# Altium project RPi-GS-CAM-SER_V1-0.PrjPcb
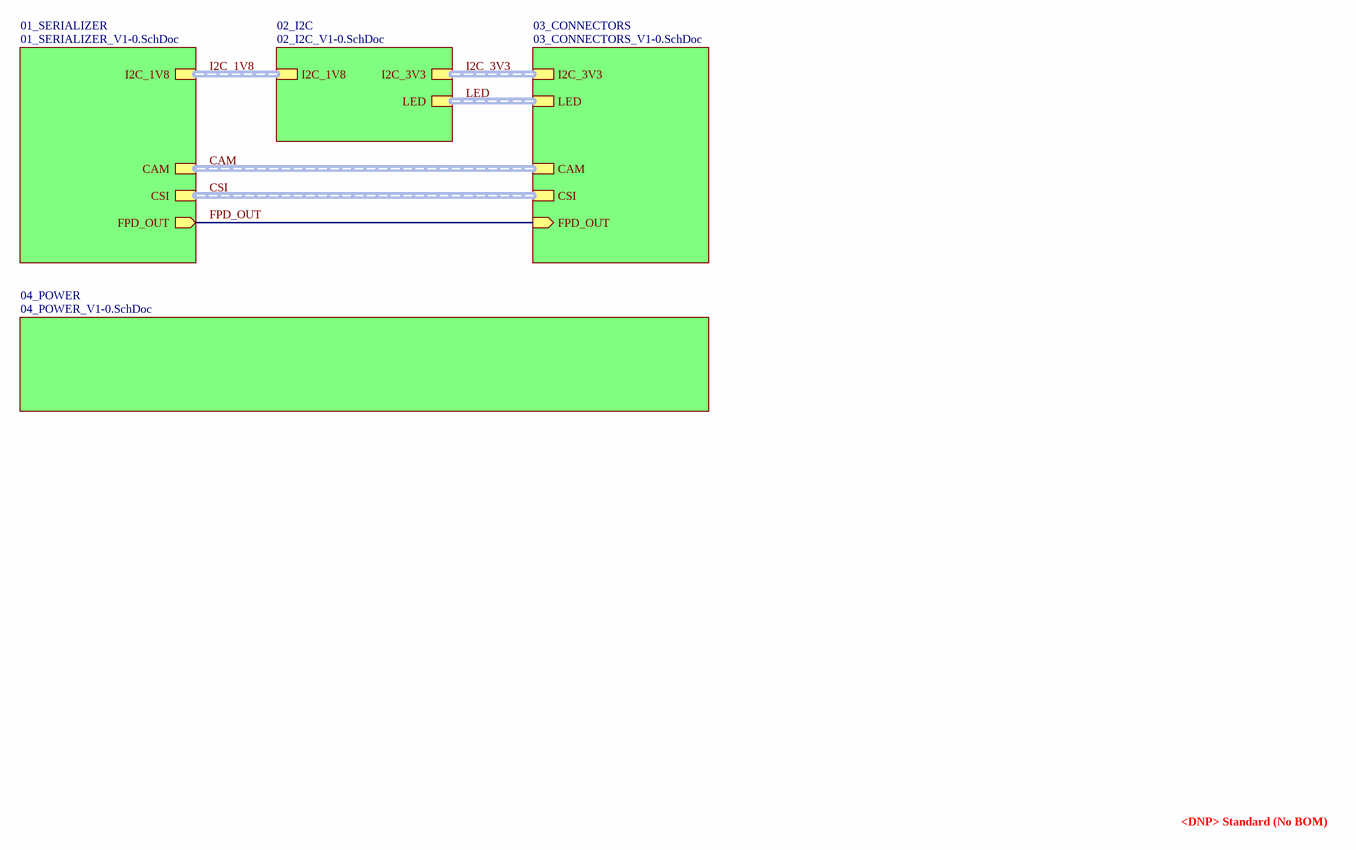
[diagram p0: 00_RPi-GS-CAM-SER_V1-0.SchDoc]
5 sheets, 156 parts. Net scope: hierarchical (ports join the sheet entries above them; power ports are global).
Board file: RPi-GS-CAM-SER_V1-0.PcbDoc
Sheets:
  00_RPi-GS-CAM-SER_V1-0.SchDoc
    01_SERIALIZER = 01_SERIALIZER_V1-0.SchDoc
    03_CONNECTORS = 03_CONNECTORS_V1-0.SchDoc
    04_POWER = 04_POWER_V1-0.SchDoc
    02_I2C = 02_I2C_V1-0.SchDoc

## Sheet 00_RPi-GS-CAM-SER_V1-0.SchDoc: RPi GS CAM SER.
size A3; Date: 2023-05-29; Author: M. Weimann; Organization: Altium Limited; Revision: 1.0; SheetNumber: 1; SheetTotal: 5; Title_Subtitle: Block Diagramm; Language: DE; Department: F&E; Filename: RPi-GS-CAM-SER_PCB_V1-0.PDF; Project: PI-0017; DocType: Stromlauf; ItemNo-PCB: n/a

### Sub-sheets
01_SERIALIZER = 01_SERIALIZER_V1-0.SchDoc: CSI (harness CSI), I2C_1V8 (harness I2C_1V8), CAM (harness CAM), FPD_OUT (out)
02_I2C = 02_I2C_V1-0.SchDoc: LED (harness LED), I2C_3V3 (harness I2C_3V3), I2C_1V8 (harness I2C_1V8)
03_CONNECTORS = 03_CONNECTORS_V1-0.SchDoc: FPD_OUT (in), I2C_3V3 (harness I2C_3V3), LED (harness LED), CSI (harness CSI), CAM (harness CAM)
04_POWER = 04_POWER_V1-0.SchDoc: no entries

### Nets
FPD_OUT: sheet 01_SERIALIZER/FPD_OUT, sheet 03_CONNECTORS/FPD_OUT

### Buses and harness runs
harness CAM = sheet 01_SERIALIZER/CAM = sheet 03_CONNECTORS/CAM
harness CSI = sheet 01_SERIALIZER/CSI = sheet 03_CONNECTORS/CSI
harness I2C_1V8 = sheet 01_SERIALIZER/I2C_1V8 = sheet 02_I2C/I2C_1V8
harness I2C_3V3 = sheet 02_I2C/I2C_3V3 = sheet 03_CONNECTORS/I2C_3V3
harness LED = sheet 02_I2C/LED = sheet 03_CONNECTORS/LED

### Notes on the sheet
- <DNP> Standard (No BOM)
- Erstellt von
- Dateiname
- ++CONFIDENTIAL++
- PCB Arts GmbH
- Dokumententyp
- Artikel-Nummer (PCB)
- Kurgartenstraße 59
- 90762 Fürth
- Elektronik- und Softwareentwicklung
- Titel, Sub-Titel
- Projekt
- Rev.
- Datum
- Sprache
- Seite
- The  information  contained  in  these  documents  is  confidential,  privileged  and  only  for  the
  information of the intended recipient and may
  not be used, published or redistributed without
  the prior written consent from PCB Arts GmbH.
- https://pcb-arts.com/
- mail@pcb-arts.com

## Sheet 01_SERIALIZER_V1-0.SchDoc: RPi GS CAM SER.
size A3; Date: 2023-05-29; Author: M. Weimann; Organization: Altium Limited; Revision: 1.0; SheetNumber: 2; SheetTotal: 5; Title_Subtitle: Serializer; Language: DE; Department: F&E; Filename: RPi-GS-CAM-SER_PCB_V1-0.PDF; Project: PI-0017; DocType: Stromlauf; ItemNo-PCB: n/a
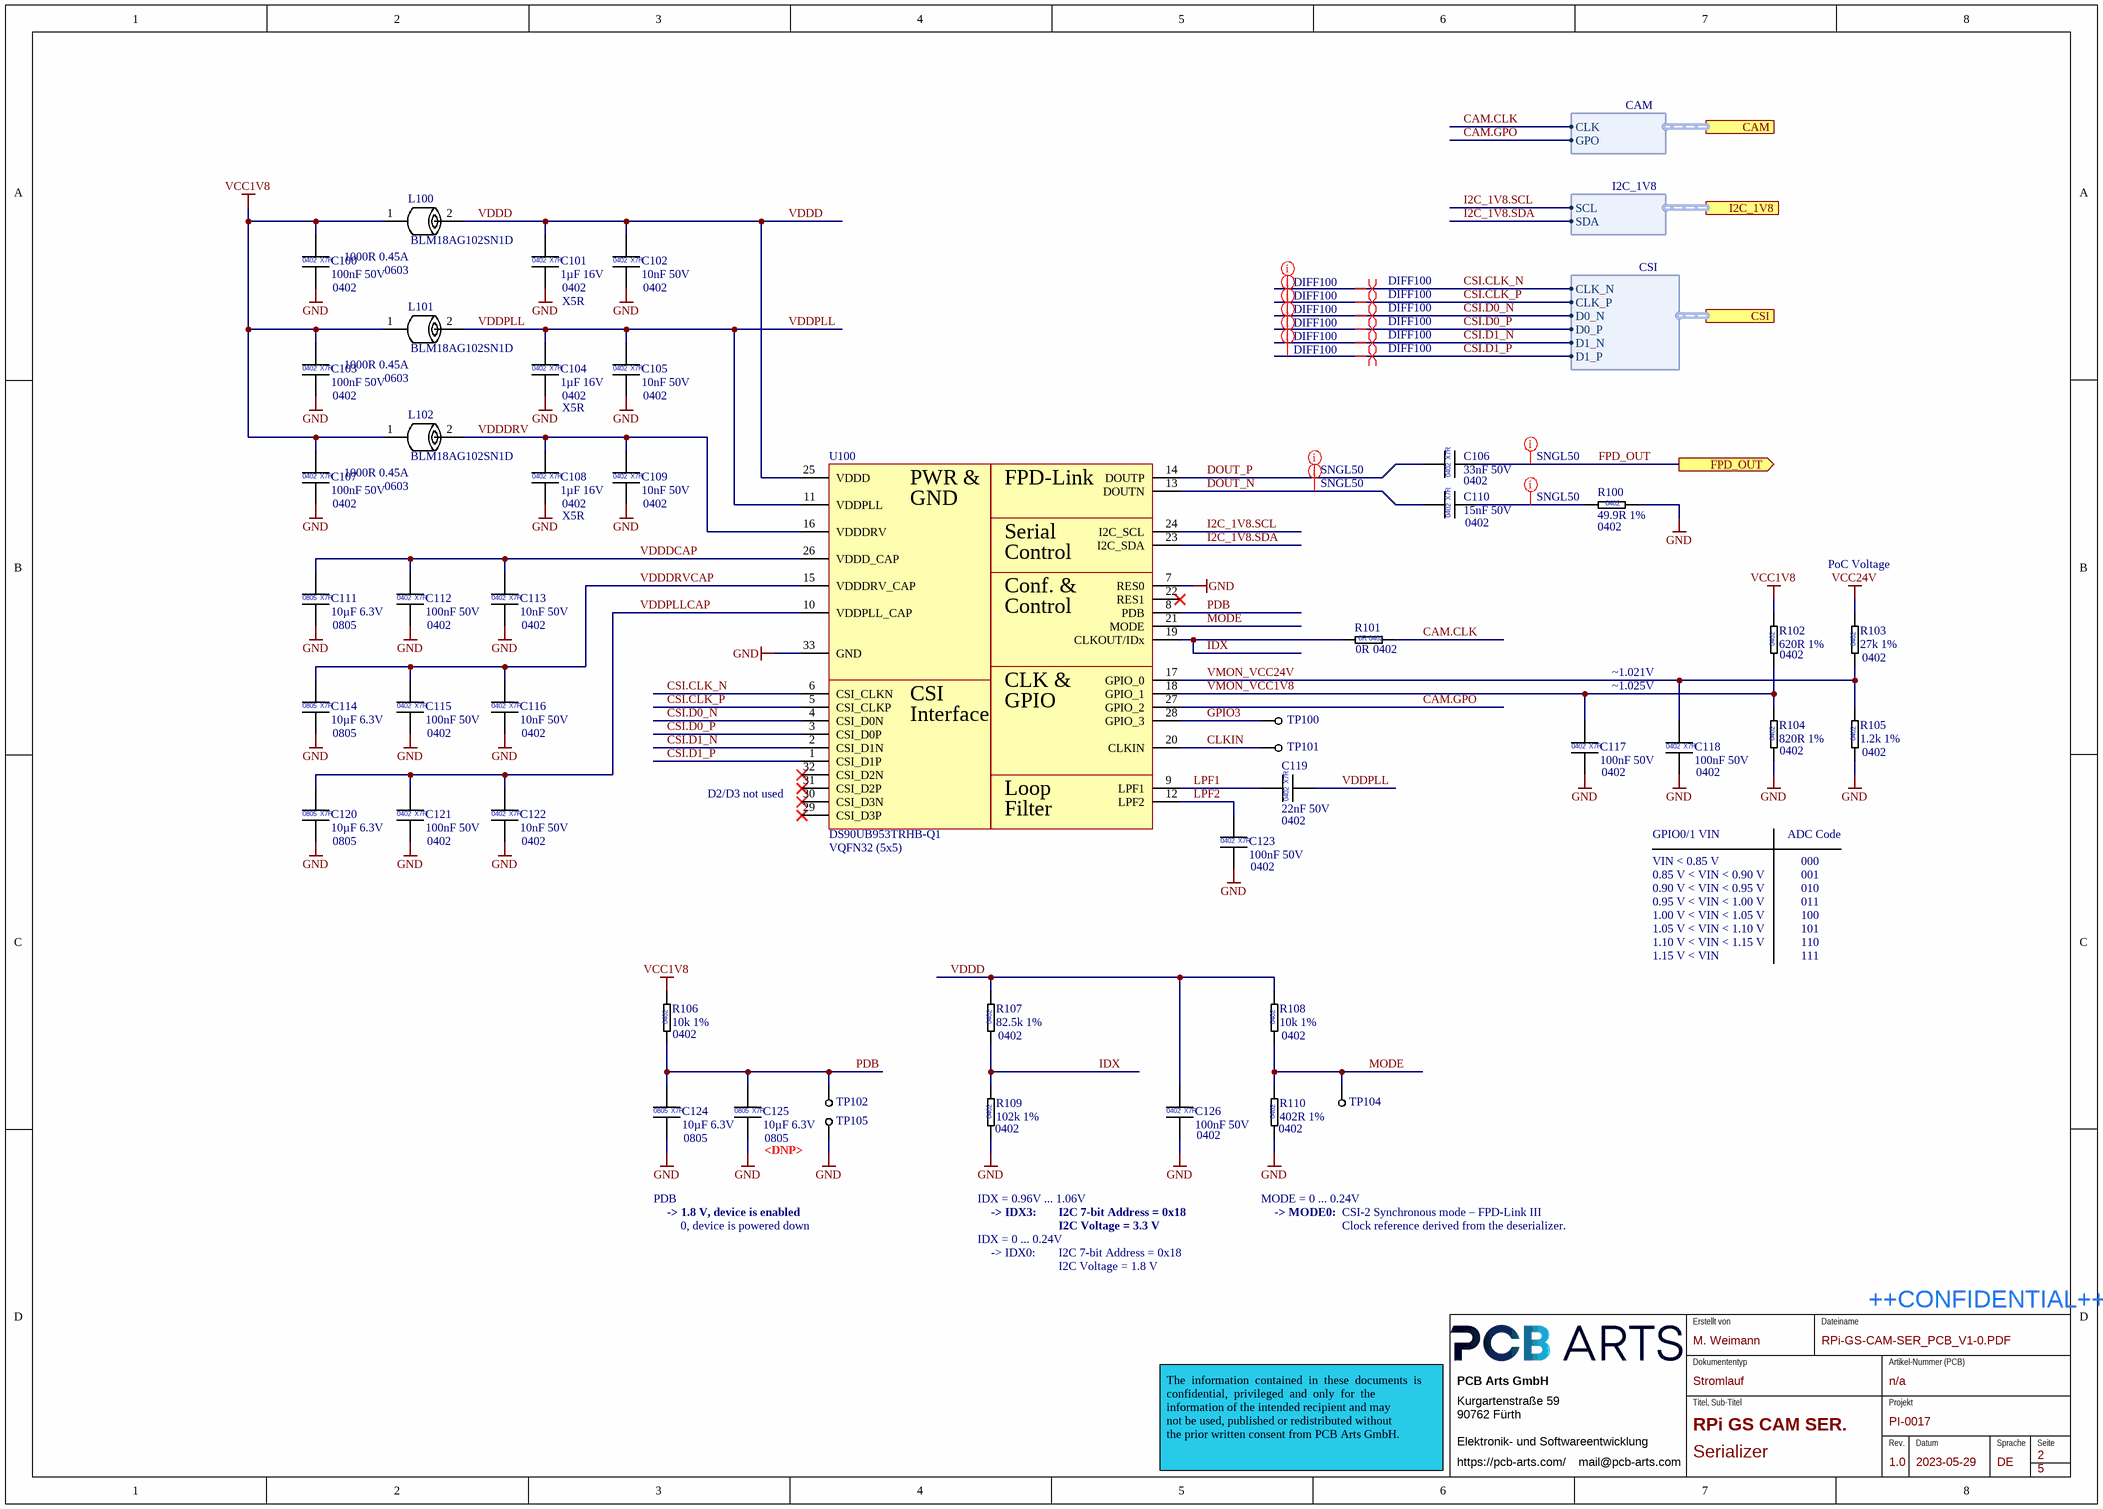
[diagram p1: 01_SERIALIZER_V1-0.SchDoc]

### Parts
C100  100nF 50V  [CAP_0402_L]
C101  1µF 16V  [CAP_0402_L]
C102  10nF 50V  [CAP_0402_L]
C103  100nF 50V  [CAP_0402_L]
C104  1µF 16V  [CAP_0402_L]
C105  10nF 50V  [CAP_0402_L]
C106  33nF 50V  [CAP_0402_L]
C107  100nF 50V  [CAP_0402_L]
C108  1µF 16V  [CAP_0402_L]
C109  10nF 50V  [CAP_0402_L]
C110  15nF 50V  [CAP_0402_L]
C111  10µF 6.3V  [CAP_0805]
C112  100nF 50V  [CAP_0402_L]
C113  10nF 50V  [CAP_0402_L]
C114  10µF 6.3V  [CAP_0805]
C115  100nF 50V  [CAP_0402_L]
C116  10nF 50V  [CAP_0402_L]
C117  100nF 50V  [CAP_0402_L]
C118  100nF 50V  [CAP_0402_L]
C119  22nF 50V  [CAP_0402_L]
C120  10µF 6.3V  [CAP_0805]
C121  100nF 50V  [CAP_0402_L]
C122  10nF 50V  [CAP_0402_L]
C123  100nF 50V  [CAP_0402_L]
C124  10µF 6.3V  [CAP_0805]
C125  10µF 6.3V  [CAP_0805]  (no BOM)
C126  100nF 50V  [CAP_0402_L]
L100  BLM18AG102SN1D  [L_0603]
L101  BLM18AG102SN1D  [L_0603]
L102  BLM18AG102SN1D  [L_0603]
R100  49.9R 1%  [RES_0402_L]
R101  0R Jumper  [RES_0402_L]  (value not drawn)
R102  620R 1%  [RES_0402_L]
R103  27k 1%  [RES_0402_L]
R104  820R 1%  [RES_0402_L]
R105  1.2k 1%  [RES_0402_L]
R106  10k 1%  [RES_0402_L]
R107  82.5k 1%  [RES_0402_L]
R108  10k 1%  [RES_0402_L]
R109  102k 1%  [RES_0402_L]
R110  402R 1%  [RES_0402_L]
TP100  Testpoint  [Testpoint 0.8mm]  (value not drawn)  (no BOM)
TP101  Testpoint  [Testpoint 0.8mm]  (value not drawn)  (no BOM)
TP102  Testpoint  [Testpoint 0.8mm]  (value not drawn)  (no BOM)
TP104  Testpoint  [Testpoint 0.8mm]  (value not drawn)  (no BOM)
TP105  Testpoint  [Testpoint 0.8mm]  (value not drawn)  (no BOM)
U100  DS90UB953TRHB-Q1  [VQFN50P500X500X100-33N]

### Ports
CAM (harness CAM, see 00_RPi-GS-CAM-SER_V1-0[4B], 03_CONNECTORS_V1-0[1B]), CSI (harness CSI, see 00_RPi-GS-CAM-SER_V1-0[4B], 03_CONNECTORS_V1-0[1B]), FPD_OUT (out, see 00_RPi-GS-CAM-SER_V1-0[4B], 03_CONNECTORS_V1-0[4A]), I2C_1V8 (harness I2C_1V8, see 00_RPi-GS-CAM-SER_V1-0[4B], 02_I2C_V1-0[1A])

### Harnesses
CSI: CLK_N, CLK_P, D0_N, D0_P, D1_P, D1_N
I2C_1V8: SCL, SDA
CAM: CLK, GPO

### Nets
GND: C100.2 C101.2 C102.2 C103.2 C104.2 C105.2 C107.2 C108.2 C109.2 C111.2 C112.2 C113.2 C114.2 C115.2 C116.2 C117.2 C118.2 C120.2 C121.2 C122.2 C123.2 C124.2 C125.2 C126.2 R100.2 R104.1 R105.1 R109.1 R110.1 TP105.1(GND) U100.7(RES0) U100.33(GND)
VCC1V8: C100.1 C103.1 C107.1 L100.1 L101.1 L102.1 R102.2 R106.2
VCC24V: R103.2
CAM.CLK: R101.2 ; port CAM.CLK
CAM.GPO: U100.27(GPIO_2) ; port CAM.GPO
CLKIN: TP101.1(GND) U100.20(CLKIN)
CSI.CLK_N: U100.6(CSI_CLKN) ; port CSI.CLK_N
CSI.CLK_P: U100.5(CSI_CLKP) ; port CSI.CLK_P
CSI.D0_N: U100.4(CSI_D0N) ; port CSI.D0_N
CSI.D0_P: U100.3(CSI_D0P) ; port CSI.D0_P
CSI.D1_N: U100.2(CSI_D1N) ; port CSI.D1_N
CSI.D1_P: U100.1(CSI_D1P) ; port CSI.D1_P
DOUT_N: C110.1 U100.13(DOUTN)
DOUT_P: C106.1 U100.14(DOUTP)
FPD_OUT: C106.2 ; port FPD_OUT
GPIO3: TP100.1(GND) U100.28(GPIO_3)
I2C_1V8.SCL: U100.24(I2C_SCL) ; port I2C_1V8.SCL
I2C_1V8.SDA: U100.23(I2C_SDA) ; port I2C_1V8.SDA
IDX: R101.1 R107.1 R109.2 U100.19(CLKOUT/IDx)
LPF1: C119.1 U100.9(LPF1)
LPF2: C123.1 U100.12(LPF2)
MODE: R108.1 R110.2 TP104.1(GND) U100.21(MODE)
PDB: C124.1 C125.1 R106.1 TP102.1(GND) U100.8(PDB)
VDDD: C101.1 C102.1 C126.1 L100.2 R107.2 R108.2 U100.25(VDDD)
VDDDCAP: C111.1 C112.1 C113.1 U100.26(VDDD_CAP)
VDDDRV: C108.1 C109.1 L102.2 U100.16(VDDDRV)
VDDDRVCAP: C114.1 C115.1 C116.1 U100.15(VDDDRV_CAP)
VDDPLL: C104.1 C105.1 C119.2 L101.2 U100.11(VDDPLL)
VDDPLLCAP: C120.1 C121.1 C122.1 U100.10(VDDPLL_CAP)
VMON_VCC1V8: C117.1 R102.1 R104.2 U100.18(GPIO_1)
VMON_VCC24V: C118.1 R103.1 R105.2 U100.17(GPIO_0)
NetC110_2: C110.2 R100.1

Not connected (* = marked no-connect by the designer): U100 22(RES1)* 29(CSI_D3P)* 30(CSI_D3N)* 31(CSI_D2P)* 32(CSI_D2N)*

### Layout directives
net class SNGL50: DOUT_N, DOUT_P, FPD_OUT, NetC110_2
differential pair; differential pair class DIFF100: CSI.CLK_N, CSI.CLK_P, CSI.D0_N, CSI.D0_P, CSI.D1_N, CSI.D1_P
net class DIFF100: CSI.CLK_N, CSI.CLK_P, CSI.D0_N, CSI.D0_P, CSI.D1_N, CSI.D1_P

### Notes on the sheet
- (near L100) 1000R 0.45A
- (near C100) 0402
- 0603
- (near C101) X5R
- (near C101) 0402
- (near C102) 0402
- (near L101) 1000R 0.45A
- (near C103) 0402
- (near C104) X5R
- (near C104) 0402
- (near C105) 0402
- (near C107) 0402
- (near L102) 1000R 0.45A
- (near L102) 0603
- (near C108) X5R
- (near C108) 0402
- (near C109) 0402
- 0402
- (near C110) 0402
- (near R100) 0402
- PoC Voltage
- (near C111) 0805
- (near C112) 0402
- (near C113) 0402
- (near R101) 0R
- (near R101) 0402
- ~1.021V
- ~1.025V
- (near R102) 0402
- (near R103) 0402
- (near C114) 0805
- (near C115) 0402
- (near C116) 0402
- (near C117) 0402
- (near C118) 0402
- (near R104) 0402
- (near R105) 0402
- (near C120) 0805
- (near C121) 0402
- (near C122) 0402
- (near U100) D2/D3 not used
- (near U100) VQFN32 (5x5)
- (near C119) 0402
- GPIO0/1 VIN
- ADC Code
- (near C123) 0402
- VIN < 0.85 V
- 0.85 V < VIN < 0.90 V
- 0.90 V < VIN < 0.95 V
- 0.95 V < VIN < 1.00 V
- 1.00 V < VIN < 1.05 V
- 000
- 001
- 010
- 011
- 100
- 1.05 V < VIN < 1.10 V
- 1.10 V < VIN < 1.15 V
- 1.15 V < VIN
- 101
- 110
- 111
- (near R106) 0402
- (near R107) 0402
- (near R108) 0402
- (near C124) 0805
- (near C125) 0805
- <DNP>
- (near R109) 0402
- (near C126) 0402
- (near R110) 0402
- PDB
- -> 1.8 V, device is enabled
- 0, device is powered down
- IDX = 0 ... 0.24V
- IDX = 0.96V ... 1.06V
- -> IDX0:
- -> IDX3:
- I2C 7-bit Address = 0x18
- I2C Voltage = 3.3 V
- MODE = 0 ... 0.24V
- -> MODE0:
- CSI-2 Synchronous mode – FPD-Link III
- Clock reference derived from the deserializer.
- I2C Voltage = 1.8 V
- Erstellt von
- Dateiname
- ++CONFIDENTIAL++
- PCB Arts GmbH
- Dokumententyp
- Artikel-Nummer (PCB)
- Kurgartenstraße 59
- 90762 Fürth
- Elektronik- und Softwareentwicklung
- Titel, Sub-Titel
- Projekt
- Rev.
- Datum
- Sprache
- Seite
- The  information  contained  in  these  documents  is  confidential,  privileged  and  only  for  the
  information of the intended recipient and may
  not be used, published or redistributed without
  the prior written consent from PCB Arts GmbH.
- https://pcb-arts.com/
- mail@pcb-arts.com
- (in symbol CAP_0402_1µF_16V) 0402; X7R
- (in symbol CAP_0402_10nF_50V) 0402; X7R
- (in symbol CAP_0402_15nF_50V) X7R; 0402
- (in symbol CAP_0402_22nF_50V) X7R; 0402
- (in symbol CAP_0402_33nF_50V) X7R; 0402
- (in symbol CAP_0402_100nF_50V) 0402; X7R
- (in symbol CAP_0805_10µF_6.3V_X7R_10%) 0805; X7R
- (in symbol DS90UB953TRHBTQ1_Serialiser CSI-2 Interface) PWR &; FPD-Link; Serial; Control; Conf. &; CLK &; CSI; GPIO; Interface; Loop; Filter
- (in symbol RES_0402_0R Jumper) 0R 0402
- (in symbol RES_0402_1.2k_1%) 0402
- (in symbol RES_0402_10k_1%) 0402
- (in symbol RES_0402_27k_1%) 0402
- (in symbol RES_0402_49.9R_1%) 0402
- (in symbol RES_0402_82.5k_1%) 0402
- (in symbol RES_0402_102k_1%) 0402
- (in symbol RES_0402_402R_1%) 0402
- (in symbol RES_0402_620R_1%) 0402
- (in symbol RES_0402_820R_1%) 0402

### Library data of the parts
C100 C103 C107 C112 C115 C117 C118 C121 C123 C126 = CAP_0402_100nF_50V: Multilayer Ceramic Capacitors MLCC - SMD/SMT 0402 50VDC; Manufacturer 1: Murata Electronics; Manufacturer 1 Prt. Nr.: GCM155L8EH104KE07D; Manufacturer 2 Prt. Nr.: UMK105B7104KV-FR; Manufacturer 2: TDK
C101 C104 C108 = CAP_0402_1µF_16V: Multilayer Ceramic Capacitors MLCC - SMD/SMT 0402 16VDC; Manufacturer 1: Taiyo Yuden; Manufacturer 1 Prt. Nr.: EMK105BJ105MVHF; Manufacturer 2 Prt. Nr.: GRM155R61E105KA12D; Manufacturer 2: Murata Electronics
C102 C105 C109 C113 C116 C122 = CAP_0402_10nF_50V: Multilayer Ceramic Capacitors MLCC - SMD/SMT 0402 50VDC; Manufacturer 1: Wurth Elektronik; Manufacturer 1 Prt. Nr.: 885012205067; Manufacturer 2 Prt. Nr.: AC0402KPX7R9BB103; Manufacturer 2: Yageo
C106 = CAP_0402_33nF_50V: Multilayer Ceramic Capacitors MLCC - SMD/SMT 0402 50VDC; Manufacturer 1: Murata; Manufacturer 1 Prt. Nr.: GRT155R71H333KE01D; Manufacturer 2 Prt. Nr.: CC0402KRX7R9BB333; Manufacturer 2: Yageo
C110 = CAP_0402_15nF_50V: Multilayer Ceramic Capacitors MLCC - SMD/SMT 0402 50VDC; Manufacturer 1: Murata; Manufacturer 1 Prt. Nr.: GRM155R71H153KA12J; Manufacturer 2 Prt. Nr.: CC0402KRX7R9BB153; Manufacturer 2: Yageo
C111 C114 C120 C124 C125 = CAP_0805_10µF_6.3V_X7R_10%: Multilayer Ceramic Capacitors MLCC - SMD/SMT 10 uF 6.3 VDC 10% 0805 X7R; Manufacturer 1: Murata Electronics; Manufacturer 1 Prt. Nr.: GRM21BR70J106KA73L; Manufacturer 2 Prt. Nr.: CGA4J1X7R0J106K125AC; Manufacturer 2: TDK
C119 = CAP_0402_22nF_50V: Multilayer Ceramic Capacitors MLCC - SMD/SMT 0402 50VDC; Manufacturer 1: Murata; Manufacturer 1 Prt. Nr.: GRT155R71H223KE01D; Manufacturer 2 Prt. Nr.: 0402B223K500CT; Manufacturer 2: Walsin
L100-L102 = BLM18AG102SN1D_Ferrite Beads 0603 1000Ohms 450mA: Ferrite Beads BLM18 1000Ohms 450mA 0,5Ohm; Manufacturer 1: Murata Electronics; Manufacturer 1 Prt. Nr.: BLM18AG102SN1D
R100 = RES_0402_49.9R_1%: Thick Film Resistors - SMD 49.9Ohm 1%; Manufacturer 1: Vishay / Dale; Manufacturer 1 Prt. Nr.: CRCW040249R9FKEDC; Manufacturer 2 Prt. Nr.: RC0402FR-7W49R9L; Manufacturer 2: Yageo
R101 = RES_0402_0R Jumper: Thick Film Resistors - SMD 0Ohm; Manufacturer 1: Vishay / Dale; Manufacturer 1 Prt. Nr.: CRCW04020000Z0EDC; Manufacturer 2 Prt. Nr.: RC0402JR-070RL; Manufacturer 2: Yageo
R102 = RES_0402_620R_1%: Thick Film Resistors - SMD 1/16watt 620ohms 1%; Manufacturer 1: Vishay / Dale; Manufacturer 1 Prt. Nr.: CRCW0402620RFKED; Manufacturer 2 Prt. Nr.: RC0402FR-07620RL; Manufacturer 2: Yageo
R103 = RES_0402_27k_1%: Thick Film Resistors - SMD 27kOhm 1%; Manufacturer 1: Vishay / Dale; Manufacturer 1 Prt. Nr.: CRCW040227K0FKEDC; Manufacturer 2 Prt. Nr.: RT0402FRE0727KL; Manufacturer 2: Yageo
R104 = RES_0402_820R_1%: Thick Film Resistors - SMD 1/16watt 820ohms 1%; Manufacturer 1: Vishay / Dale; Manufacturer 1 Prt. Nr.: CRCW0402820RFKED; Manufacturer 2 Prt. Nr.: RC0402FR-07820RL; Manufacturer 2: Yageo
R105 = RES_0402_1.2k_1%: Thick Film Resistors - SMD 1/16watt 1.2Kohms 1%; Manufacturer 1: Vishay / Dale; Manufacturer 1 Prt. Nr.: CRCW04021K20FKEDC; Manufacturer 2 Prt. Nr.: RC0402FR-7W1K2L; Manufacturer 2: Yageo
R106 R108 = RES_0402_10k_1%: Thick Film Resistors - SMD 10kOhm 1%; Manufacturer 1: Vishay / Dale; Manufacturer 1 Prt. Nr.: CRCW040210K0FKEDC; Manufacturer 2 Prt. Nr.: RC0402FR-7W10KL; Manufacturer 2: Yageo
R107 = RES_0402_82.5k_1%: Thick Film Resistors - SMD 1/16W 82.5Kohms 1%; Manufacturer 1: Vishay / Dale; Manufacturer 1 Prt. Nr.: CRCW040282k5FKEDC; Manufacturer 2 Prt. Nr.: CR0402-FX-8252GLF; Manufacturer 2: Bourns
R109 = RES_0402_102k_1%: Thick Film Resistors - SMD 102KOHM 1/16WATT 1%; Manufacturer 1: Vishay / Dale; Manufacturer 1 Prt. Nr.: CRCW0402102kFKEDC; Manufacturer 2 Prt. Nr.: CR0402-FX-1023GLF; Manufacturer 2: Bourns
R110 = RES_0402_402R_1%: Thick Film Resistors - SMD 402Ohms 1/16W 0402 1%; Manufacturer 1: Vishay / Dale; Manufacturer 1 Prt. Nr.: CRCW0402402RFKEDC; Manufacturer 2 Prt. Nr.: RC0402FR-7W402RL; Manufacturer 2: Yageo
TP100-TP102 TP104 TP105 = Testpoint 0.8mm
U100 = DS90UB953TRHBTQ1_Serialiser CSI-2 Interface: Serialisierer & Deserialisierer - Serdes 2 MP MIPI CSI-2 FPD-Link III serializer for 2MP/60fps cameras & radar 32-VQFN -40 to 105; Manufacturer 1: Texas Instruments; Manufacturer 1 Prt. Nr.: DS90UB953TRHBTQ1

## Sheet 03_CONNECTORS_V1-0.SchDoc: RPi GS CAM SER.
size A3; Date: 2023-05-29; Author: M. Weimann; Organization: Altium Limited; Revision: 1.0; SheetNumber: 4; SheetTotal: 5; Title_Subtitle: Connectors; Language: DE; Department: F&E; Filename: RPi-GS-CAM-SER_PCB_V1-0.PDF; Project: PI-0017; DocType: Stromlauf; ItemNo-PCB: n/a
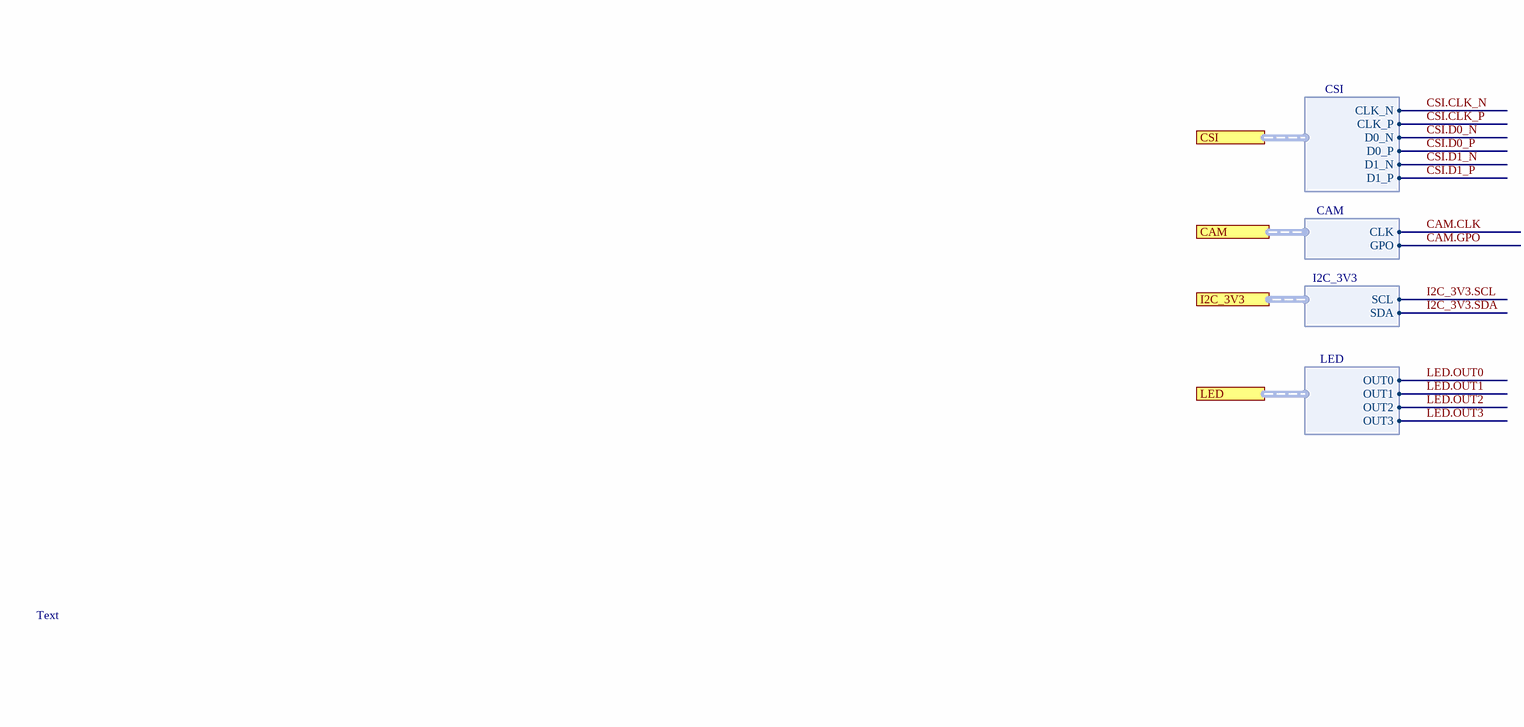
[diagram p2: 03_CONNECTORS_V1-0.SchDoc, left]
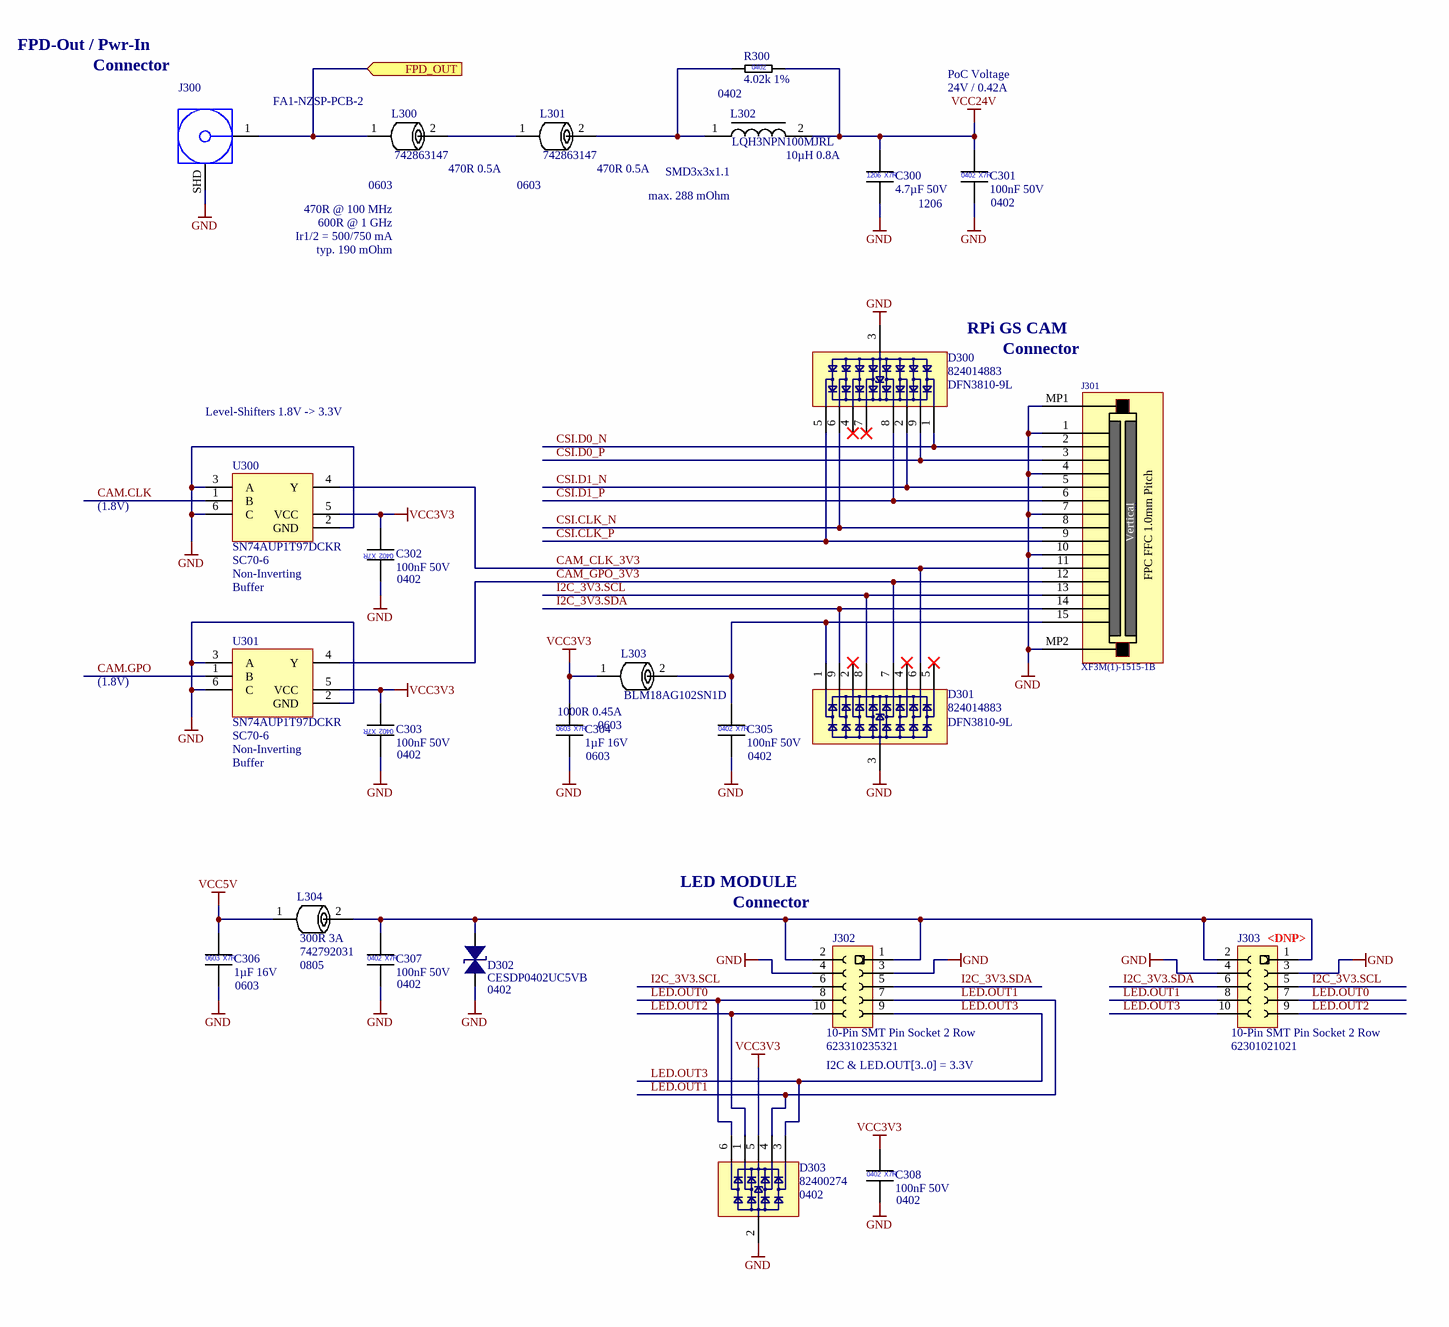
[diagram p3: 03_CONNECTORS_V1-0.SchDoc, right]

### Parts
C300  4.7µF 50V  [CAP_1206]
C301  100nF 50V  [CAP_0402_L]
C302  100nF 50V  [CAP_0402_L]
C303  100nF 50V  [CAP_0402_L]
C304  1µF 16V  [CAP_0603_L]
C305  100nF 50V  [CAP_0402_L]
C306  1µF 16V  [CAP_0603_L]
C307  100nF 50V  [CAP_0402_L]
C308  100nF 50V  [CAP_0402_L]
D300  824014883  [WE-TVS-DFN3810-9L]
D301  824014883  [WE-TVS-DFN3810-9L]
D302  CESDP0402UC5VB  [TVS_0402]  (value not drawn)
D303  82400274  [SOT65P210X100-6N]
J300  FA1-NZSP-PCB-2  [FA1-NZSP-PCB-2]  (value not drawn)
J301  XF3M(1)-1515-1B  [XF3M(1)-1515-1B]
J302  10-Pin SMT Pin Socket 2 Row  [623310235321]
J303  10-Pin SMT Pin Socket 2 Row  [62301021021]  (no BOM)
L300  742863147  [L_0603]
L301  742863147  [L_0603]
L302  LQH3NPN100MJRL  [LQH3NPN100MJRL]
L303  BLM18AG102SN1D  [L_0603]
L304  742792031  [L_0805]
R300  4.02k 1%  [RES_0402_L]
U300  SN74AUP1T97DCKR  [SOT65P210X100-6N]
U301  SN74AUP1T97DCKR  [SOT65P210X100-6N]

### Ports
CAM (harness CAM, see 00_RPi-GS-CAM-SER_V1-0[5B], 01_SERIALIZER_V1-0[7A]), CSI (harness CSI, see 00_RPi-GS-CAM-SER_V1-0[5B], 01_SERIALIZER_V1-0[7A]), FPD_OUT (in, see 00_RPi-GS-CAM-SER_V1-0[5B], 01_SERIALIZER_V1-0[7B]), I2C_3V3 (harness I2C_3V3, see 00_RPi-GS-CAM-SER_V1-0[5B], 02_I2C_V1-0[6A]), LED (harness LED, see 00_RPi-GS-CAM-SER_V1-0[5B], 02_I2C_V1-0[7C])

### Harnesses
I2C_3V3: SCL, SDA
LED: OUT0, OUT1, OUT2, OUT3
CSI: CLK_N, CLK_P, D0_N, D0_P, D1_P, D1_N
CAM: CLK, GPO

### Nets
GND: C300.2 C301.2 C302.1 C303.1 C304.2 C305.2 C306.2 C307.2 C308.2 D300.3(GND) D301.3(GND) D302.2 D303.2(GND) J300.SHD J301.1 J301.4 J301.7 J301.10 J301.MP1 J301.MP2 J302.3 J302.4 J303.3 J303.4 U300.2(GND) U300.3(A) U300.6(C) U301.2(GND) U301.3(A) U301.6(C)
VCC3V3: C302.2 C303.2 C304.1 C308.1 D303.5(VDD) L303.1 U300.5(VCC) U301.5(VCC)
VCC5V: C306.1 L304.1
VCC24V: C300.1 C301.1 L302.2 R300.2
CAM.CLK: U300.1(B) ; port CAM.CLK
CAM.GPO: U301.1(B) ; port CAM.GPO
CAM_CLK_3V3: D301.6(IO5) J301.11 U300.4(Y)
CAM_GPO_3V3: D301.7(IO6) J301.12 U301.4(Y)
CSI.CLK_N: D300.6(IO5) J301.8 ; port CSI.CLK_N
CSI.CLK_P: D300.5(IO4) J301.9 ; port CSI.CLK_P
CSI.D0_N: D300.1(IO1) J301.2 ; port CSI.D0_N
CSI.D0_P: D300.9(IO8) J301.3 ; port CSI.D0_P
CSI.D1_N: D300.2(IO2) J301.5 ; port CSI.D1_N
CSI.D1_P: D300.8(IO7) J301.6 ; port CSI.D1_P
FPD_OUT: J300.1(Signal) L300.1 ; port FPD_OUT
I2C_3V3.SCL: D301.8(IO7) J301.13 J302.6 J303.5 ; port I2C_3V3.SCL
I2C_3V3.SDA: D301.9(IO8) J301.14 J302.5 J303.6 ; port I2C_3V3.SDA
LED.OUT0: D303.6(IO4) J302.8 J303.7 ; port LED.OUT0
LED.OUT1: D303.4(IO3) J302.7 J303.8 ; port LED.OUT1
LED.OUT2: D303.1(IO1) J302.10 J303.9 ; port LED.OUT2
LED.OUT3: D303.3(IO2) J302.9 J303.10 ; port LED.OUT3
NetC305_1: C305.1 D301.1(IO1) J301.15 L303.2
NetC307_1: C307.1 D302.1 J302.1 J302.2 J303.1 J303.2 L304.2
NetL300_2: L300.2 L301.1
NetL301_2: L301.2 L302.1 R300.1

Not connected (* = marked no-connect by the designer): D300 4(IO3)* 7(IO6)*; D301 2(IO2)* 4(IO3)* 5(IO4)*

### Notes on the sheet
- FPD-Out / Pwr-In
- Connector
- (near R300) 0402
- PoC Voltage
- (near J300) FA1-NZSP-PCB-2
- 24V / 0.42A
- (near L300) 0603
- 470R @ 100 MHz
- (near L300) 470R 0.5A
- (near L301) 0603
- (near L301) 470R 0.5A
- (near L302) SMD3x3x1.1
- max. 288 mOhm
- (near L302) 10µH 0.8A
- (near C300) 1206
- (near C301) 0402
- Ir1/2 = 500/750 mA
- 600R @ 1 GHz
- typ. 190 mOhm
- RPi GS CAM
- Level-Shifters 1.8V -> 3.3V
- (near D300) DFN3810-9L
- (near J301) Connector
- (1.8V)
- (near U300) SC70-6
- (near U300) Non-Inverting
- Buffer
- (near C302) 0402
- (near U301) SC70-6
- (near U301) Non-Inverting
- (near C303) 0402
- 0603
- 1000R 0.45A
- (near D301) DFN3810-9L
- (near C304) 0603
- (near C305) 0402
- LED MODULE
- (near L304) 300R 3A
- (near J302) Connector
- (near J303) <DNP>
- Text
- (near C306) 0603
- 0805
- (near C307) 0402
- (near D302) CESDP0402UC5VB
- (near D302) 0402
- (near J302) 623310235321
- (near J302) I2C & LED.OUT[3..0] = 3.3V
- (near J303) 62301021021
- (near D303) 0402
- (near C308) 0402
- Erstellt von
- Dateiname
- ++CONFIDENTIAL++
- PCB Arts GmbH
- Dokumententyp
- Artikel-Nummer (PCB)
- Kurgartenstraße 59
- 90762 Fürth
- Elektronik- und Softwareentwicklung
- Titel, Sub-Titel
- Projekt
- Rev.
- Datum
- Sprache
- Seite
- The  information  contained  in  these  documents  is  confidential,  privileged  and  only  for  the
  information of the intended recipient and may
  not be used, published or redistributed without
  the prior written consent from PCB Arts GmbH.
- https://pcb-arts.com/
- mail@pcb-arts.com
- (in symbol CAP_0402_100nF_50V) 0402; X7R
- (in symbol CAP_0603_1µF_16V_X7R_10%) 0603; X7R
- (in symbol CAP_1206_4.7µF_50V_X7R_10%) 1206; X7R
- (in symbol RES_0402_4.02k_1%) 0402
- (in symbol XF3M(1)-1515-1B_15Pol FFC FPC Connector SMD) Vertical; FPC FFC 1.0mm Pitch

### Library data of the parts
C300 = CAP_1206_4.7µF_50V_X7R_10%: Multilayer Ceramic Capacitors MLCC - SMD/SMT 4.7 uF 50 VDC 10% 1206 X7R; Manufacturer 1: Murata Electronics; Manufacturer 1 Prt. Nr.: GRM31CR71H475KA12L; Manufacturer 2 Prt. Nr.: C1206X475K5RACAUTO; Manufacturer 2: Kemet
C301-C303 C305 C307 C308 = CAP_0402_100nF_50V: as C100 on sheet 01_SERIALIZER_V1-0; Manufacturer 2: TDK
C304 C306 = CAP_0603_1µF_16V_X7R_10%: Multilayer Ceramic Capacitors MLCC - SMD/SMT 0603 16VDC 1uF 10% X7R 0.8mm; Manufacturer 1: TDK; Manufacturer 1 Prt. Nr.: C1608X7R1C105K080AC; Manufacturer 2 Prt. Nr.: C0603C105K4RACTU; Manufacturer 2: KEMET
D300 D301 = 824014883_ESD-Suppressors_TVS-Diodes_3.3V_0.5pF_8Chnl: ESD Suppressors / TVS Diodes WE-TVS Diode Array 3.3V 0.5pF 8Channel; Manufacturer 1: Wurth Elektronik; Manufacturer 1 Prt. Nr.: 824014883
D302 = CESDP0402UC5VB_TVS Diode 0402: Low Capacitance ESD Protection Diode 0402; Manufacturer 1: CREATEK; Manufacturer 2 Prt. Nr.: BPESD0402-05ST; Manufacturer 1 Prt. Nr.: CESDP0402UC5VB; Manufacturer 2: BORN
D303 = 82400274_ESD-Suppressors_TVS-Diodes_5V_1.2pF_4Chnl: ESD Suppressors / TVS Diodes WE-TVS High Speed 5uA 5VDC 4+1; Manufacturer 1: Wurth Elektronik; Manufacturer 1 Prt. Nr.: 82400274
J300 = FA1-NZSP-PCB-2_FAKRA Key-Z Connector: FAKRA GEN 1 PCB Through Hole Straight Plug 50 Ohm Z Key Code; Manufacturer 1: Amphenol RF; Manufacturer 1 Prt. Nr.: FA1-NZSP-PCB-2
J301 = XF3M(1)-1515-1B_15Pol FFC FPC Connector SMD: 1.00mm Pitch RotaryBackLock FFC/FPC Connector, Surface Mount, Right-Angle,, Dual-Sided Contact Style, 15 Circuits; Manufacturer 1: Omron; Manufacturer 1 Prt. Nr.: XF3M(1)-1515-1B
J302 = 623310235321_WR-PHD_1.27mm_10Pin_SMT_Pin_Socket_2_Row_BottomEntry: Headers & Wire Housings WR-PHD 1.27mm SMT St SMT 10P 2Row H=2.2mm; Manufacturer 1: Wurth Elektronik; Manufacturer 1 Prt. Nr.: 623310235321
J303 = 62301021021_WR-PHD_1.27mm_10Pin_SMT_Pin_Socket_2_Row_TopEntry: Headers & Wire Housings WR-PHD 1.27 mm Dual SMT Socket Header H= 4.6mm; Manufacturer 1: Wurth Elektronik; Manufacturer 1 Prt. Nr.: 62301021021
L300 L301 = 742863147_Ferrite_Beads_0603_470Ohms_500mA: Ferrite Beads WE-CBF HF 0603 SMD 100MHz 470Ohm 500mA; Manufacturer 1: Wurth Elektronik; Manufacturer 1 Prt. Nr.: 742863147
L302 = 10uH 0.8A 240mΩ  LQH3NPN100MJRL: 10uH ±20% 0.8A 240mΩ SMD,3.0x3.0x1.1mm Chip Inductor; Manufacturer 1: Murata Electronics; Manufacturer 1 Prt. Nr.: LQH3NPN100MJRL
L303 = BLM18AG102SN1D_Ferrite Beads 0603 1000Ohms 450mA: as L100 on sheet 01_SERIALIZER_V1-0; Manufacturer 1 Prt. Nr.: BLM18AG102SN1D
L304 = 742792031 _Ferrite_Beads_0805_300Ohms_3000mA: Ferrite Beads WE-CBF 0805 200MHz 300Ohm 3000mA AEC-Q200; Manufacturer 1: Wurth Elektronik; Manufacturer 1 Prt. Nr.: 742792031
R300 = RES_0402_4.02k_1%: Thick Film Resistors - SMD 4.02kOhm 1%; Manufacturer 1: Vishay / Dale; Manufacturer 1 Prt. Nr.: CRCW04024K02FKEDC; Manufacturer 2 Prt. Nr.: RC0402FR-134K02L; Manufacturer 2: Yageo
U300 U301 = SN74AUP1T97DCKR _SingleSupp_Vlt-Lvl_Transl_9-Conf-Logic-Gates: Translation - Single-Supply Voltage-level Translator / With Nine Configurable Gate Logic Functions; Manufacturer 1: Texas Instruments; Manufacturer 1 Prt. Nr.: SN74AUP1T97DCKR

## Sheet 04_POWER_V1-0.SchDoc: RPi GS CAM SER.
size A3; Date: 2023-05-29; Author: M. Weimann; Organization: Altium Limited; Revision: 1.0; SheetNumber: 5; SheetTotal: 5; Title_Subtitle: Power Supplies; Language: DE; Department: F&E; Filename: RPi-GS-CAM-SER_PCB_V1-0.PDF; Project: PI-0017; DocType: Stromlauf; ItemNo-PCB: n/a
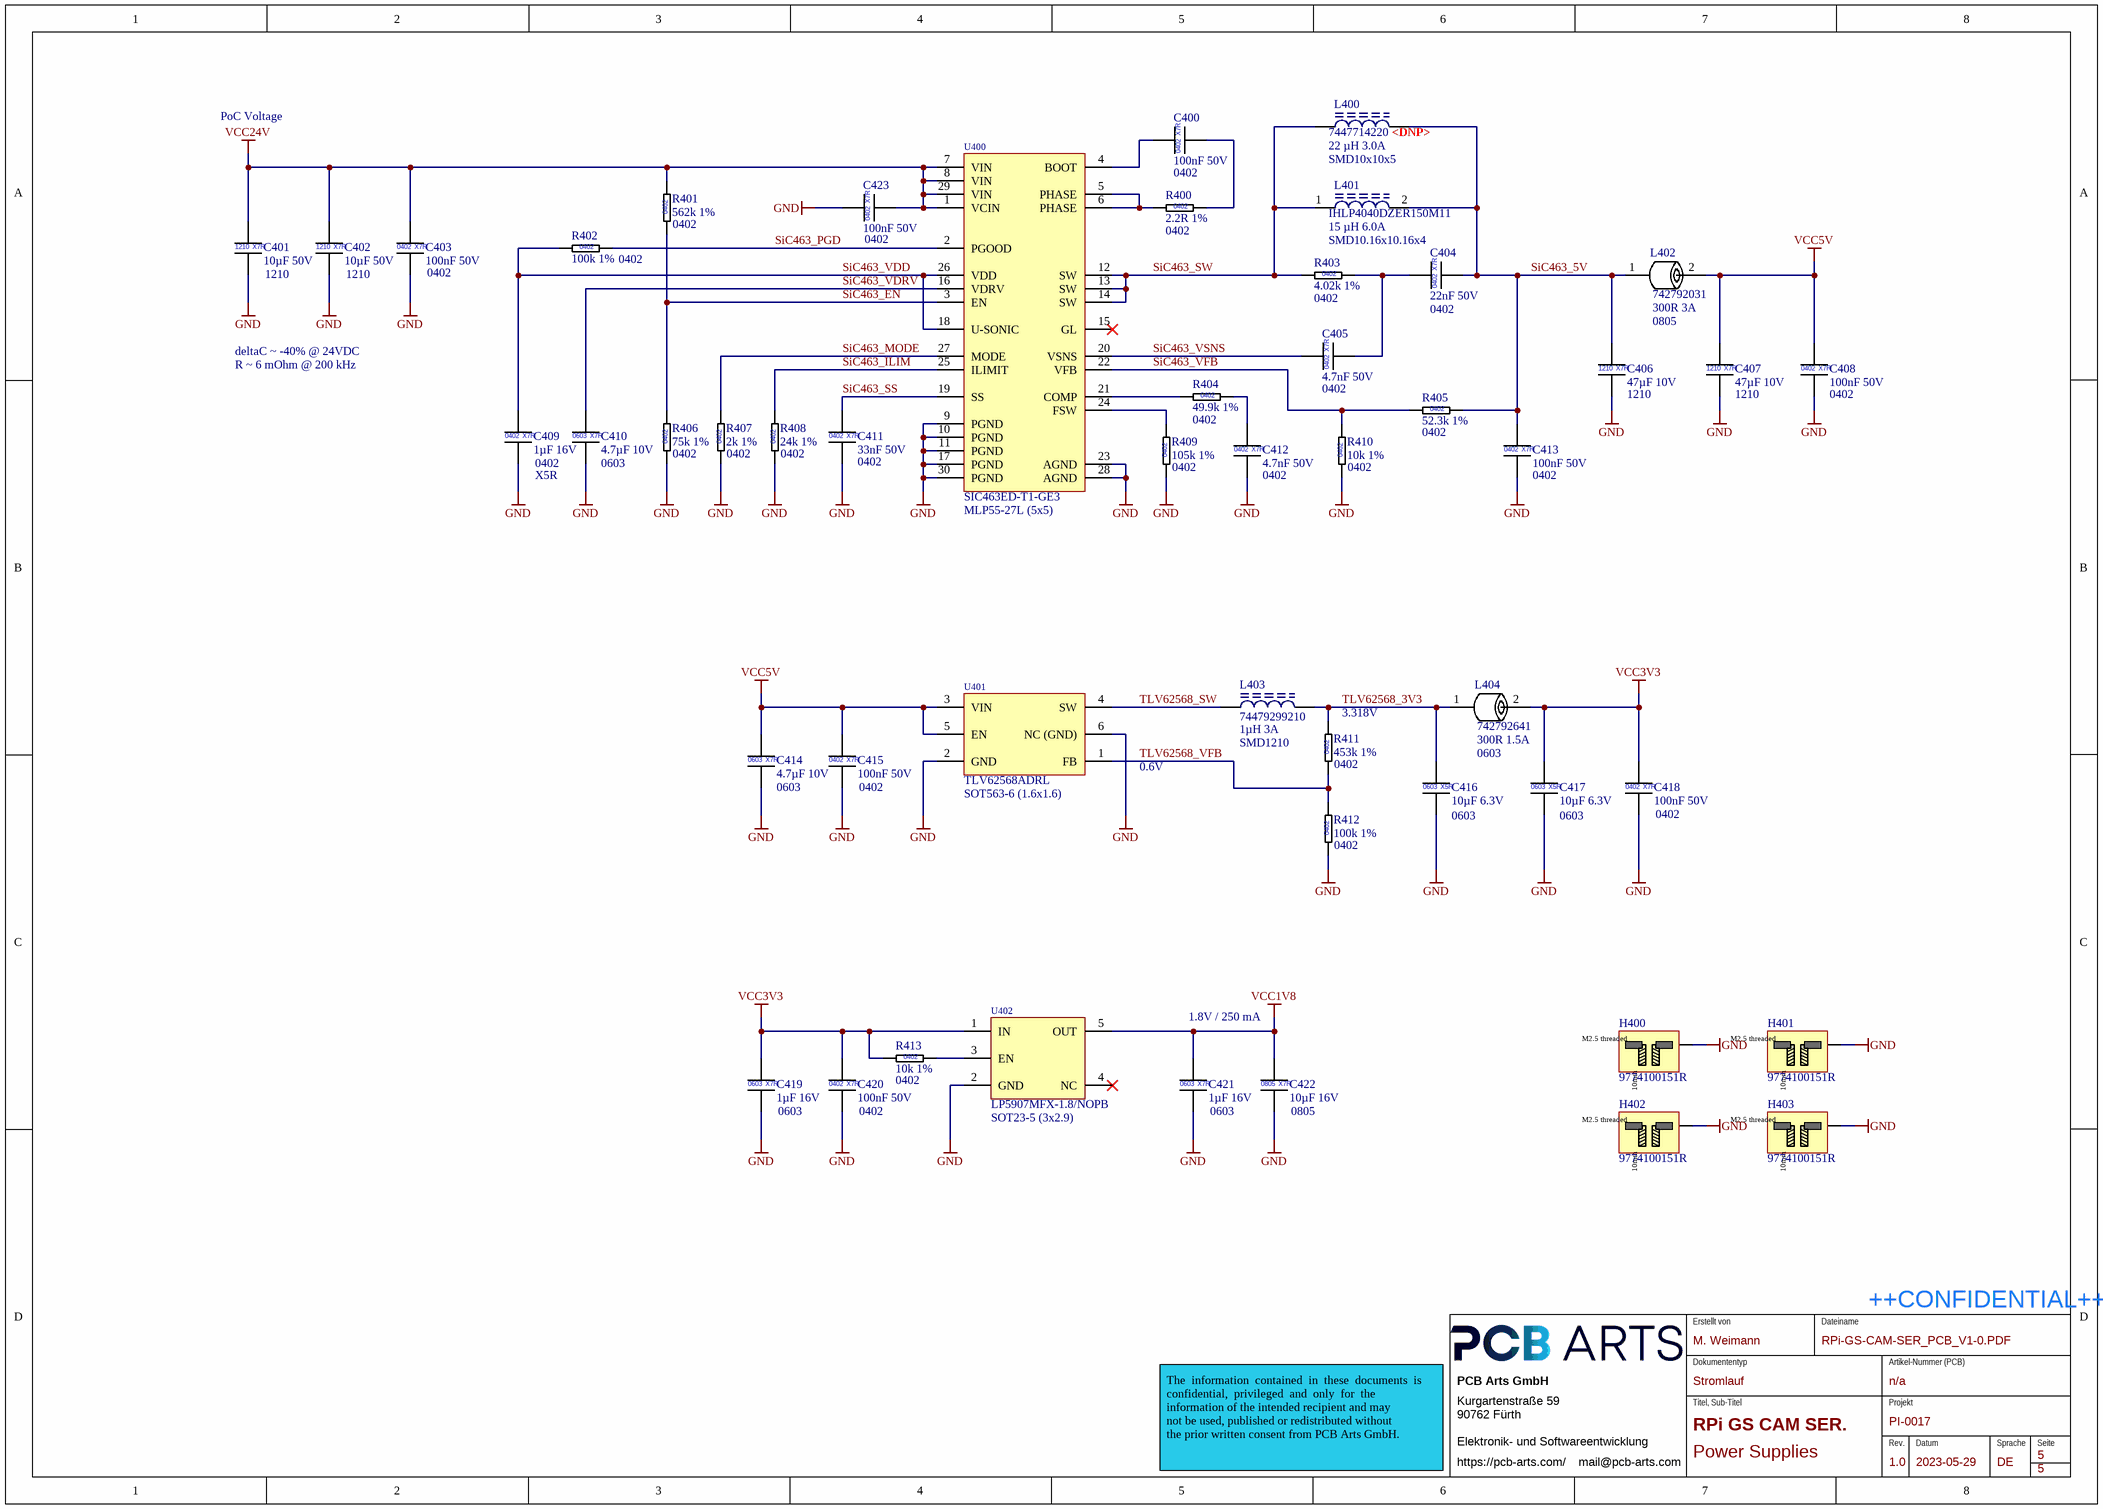
[diagram p4: 04_POWER_V1-0.SchDoc]

### Parts
C400  100nF 50V  [CAP_0402_L]
C401  10µF 50V  [CAP_1210]
C402  10µF 50V  [CAP_1210]
C403  100nF 50V  [CAP_0402_L]
C404  22nF 50V  [CAP_0402_L]
C405  4.7nF 50V  [CAP_0402_L]
C406  47µF 10V  [CAP_1210]
C407  47µF 10V  [CAP_1210]
C408  100nF 50V  [CAP_0402_L]
C409  1µF 16V  [CAP_0402_L]
C410  4.7µF 10V  [CAP_0603_L]
C411  33nF 50V  [CAP_0402_L]
C412  4.7nF 50V  [CAP_0402_L]
C413  100nF 50V  [CAP_0402_L]
C414  4.7µF 10V  [CAP_0603_L]
C415  100nF 50V  [CAP_0402_L]
C416  10µF 6.3V  [CAP_0603_L]
C417  10µF 6.3V  [CAP_0603_L]
C418  100nF 50V  [CAP_0402_L]
C419  1µF 16V  [CAP_0603_L]
C420  100nF 50V  [CAP_0402_L]
C421  1µF 16V  [CAP_0603_L]
C422  10µF 16V  [CAP_0805]
C423  100nF 50V  [CAP_0402_L]
H400  9774100151R  [9774100151R]
H401  9774100151R  [9774100151R]
H402  9774100151R  [9774100151R]
H403  9774100151R  [9774100151R]
L400  7447714220  [WE-PD_1050]  (no BOM)
L401  IHLP4040DZER150M11  [IHLP-4040DZ-11]
L402  742792031  [L_0805]
L403  74479299210  [WE-PMCI_1210]
L404  742792641  [L_0603]
R400  2.2R 1%  [RES_0402_L]
R401  562k 1%  [RES_0402_L]
R402  100k 1%  [RES_0402_L]
R403  4.02k 1%  [RES_0402_L]
R404  49.9k 1%  [RES_0402_L]
R405  52.3k 1%  [RES_0402_L]
R406  75k 1%  [RES_0402_L]
R407  2k 1%  [RES_0402_L]
R408  24k 1%  [RES_0402_L]
R409  105k 1%  [RES_0402_L]
R410  10k 1%  [RES_0402_L]
R411  453k 1%  [RES_0402_L]
R412  100k 1%  [RES_0402_L]
R413  10k 1%  [RES_0402_L]
U400  SIC463ED-T1-GE3  [VISHAY_MLP55-27L]
U401  TLV62568ADRL  [SON50P150X80-6N]
U402  LP5907MFX-1.8/NOPB  [SOT95P285X140-5N]

### Nets
GND: C401.2 C402.2 C403.2 C406.2 C407.2 C408.2 C409.2 C410.2 C411.2 C412.2 C413.2 C414.2 C415.2 C416.2 C417.2 C418.2 C419.2 C420.2 C421.2 C422.2 C423.1 H400.1 H401.1 H402.1 H403.1 R406.1 R407.1 R408.1 R409.1 R410.1 R412.1 U400.9(PGND) U400.10(PGND) U400.11(PGND) U400.17(PGND) U400.23(AGND) U400.28(AGND) U400.30(PGND) U401.2(GND) U401.6(NC_(GND)) U402.2(GND)
VCC1V8: C421.1 C422.1 U402.5(OUT)
VCC3V3: C417.1 C418.1 C419.1 C420.1 L404.2 R413.1 U402.1(IN)
VCC5V: C407.1 C408.1 C414.1 C415.1 L402.2 U401.3(VIN) U401.5(EN)
VCC24V: C401.1 C402.1 C403.1 C423.2 R401.2 U400.1(VCIN) U400.7(VIN) U400.8(VIN) U400.29(VIN)
SiC463_5V: C404.2 C406.1 C413.1 L400.2 L401.2 L402.1 R405.2
SiC463_EN: R401.1 R406.2 U400.3(EN)
SiC463_ILIM: R408.2 U400.25(ILIMIT)
SiC463_MODE: R407.2 U400.27(MODE)
SiC463_PGD: R402.2 U400.2(PGOOD)
SiC463_SS: C411.1 U400.19(SS)
SiC463_SW: L400.1 L401.1 R403.1 U400.12(SW) U400.13(SW) U400.14(SW)
SiC463_VDD: C409.1 R402.1 U400.18(U-SONIC) U400.26(VDD)
SiC463_VDRV: C410.1 U400.16(VDRV)
SiC463_VFB: R405.1 R410.2 U400.22(VFB)
SiC463_VSNS: C405.1 U400.20(VSNS)
TLV62568_3V3: C416.1 L403.2 L404.1 R411.2
TLV62568_SW: L403.1 U401.4(SW)
TLV62568_VFB: R411.1 R412.2 U401.1(FB)
NetC400_1: C400.1 U400.4(BOOT)
NetC400_2: C400.2 R400.2
NetC404_1: C404.1 C405.2 R403.2
NetC412_1: C412.1 R404.2
NetR400_1: R400.1 U400.5(PHASE) U400.6(PHASE)
NetR404_1: R404.1 U400.21(COMP)
NetR409_2: R409.2 U400.24(FSW)
NetR413_2: R413.2 U402.3(EN)

Not connected (* = marked no-connect by the designer): U400 15(GL)*; U402 4(NC)*

### Notes on the sheet
- PoC Voltage
- 0402
- (near L400) 22 µH 3.0A
- SMD10x10x5
- (near L400) <DNP>
- (near R401) 0402
- (near C423) 0402
- (near R400) 0402
- (near L401) 15 µH 6.0A
- SMD10.16x10.16x4
- (near C401) 1210
- (near C402) 1210
- (near C403) 0402
- (near R402) 0402
- (near R403) 0402
- (near C404) 0402
- (near L402) 300R 3A
- deltaC ~ -40% @ 24VDC
- R ~ 6 mOhm @ 200 kHz
- 0805
- (near R405) 0402
- (near C406) 1210
- (near C407) 1210
- (near C408) 0402
- X5R
- (near C410) 0603
- (near R406) 0402
- (near R407) 0402
- (near R408) 0402
- (near C411) 0402
- (near U400) MLP55-27L (5x5)
- (near R409) 0402
- (near C412) 0402
- (near R410) 0402
- (near C413) 0402
- (near R411) 3.318V
- 0.6V
- (near L403) 1µH 3A
- SMD1210
- (near R411) 0402
- 300R 1.5A
- 0603
- (near C414) 0603
- (near C415) 0402
- (near U401) SOT563-6 (1.6x1.6)
- (near R412) 0402
- (near C416) 0603
- (near C417) 0603
- (near C418) 0402
- 1.8V / 250 mA
- (near C419) 0603
- (near C420) 0402
- (near R413) 0402
- (near U402) SOT23-5 (3x2.9)
- (near C421) 0603
- (near C422) 0805
- Erstellt von
- Dateiname
- ++CONFIDENTIAL++
- PCB Arts GmbH
- Dokumententyp
- Artikel-Nummer (PCB)
- Kurgartenstraße 59
- 90762 Fürth
- Elektronik- und Softwareentwicklung
- Titel, Sub-Titel
- Projekt
- Rev.
- Datum
- Sprache
- Seite
- The  information  contained  in  these  documents  is  confidential,  privileged  and  only  for  the
  information of the intended recipient and may
  not be used, published or redistributed without
  the prior written consent from PCB Arts GmbH.
- https://pcb-arts.com/
- mail@pcb-arts.com
- (in symbol CAP_0402_1µF_16V) 0402; X7R
- (in symbol CAP_0402_4.7nF_50V_X7R_10%) X7R; 0402
- (in symbol CAP_0402_22nF_50V) X7R; 0402
- (in symbol CAP_0402_33nF_50V) 0402; X7R
- (in symbol CAP_0402_100nF_50V) 0402; X7R
- (in symbol CAP_0603_1µF_16V_X7R_10%) 0603; X7R
- (in symbol CAP_0603_4.7µF_10V_X7R_10%) 0603; X7R
- (in symbol CAP_0603_10µF_6.3V) 0603; X5R
- (in symbol CAP_0805_10µF_16V_X7R_10%) 0805; X7R
- (in symbol CAP_1210_10µF_50V_X7R_10%) 1210; X7R
- (in symbol CAP_1210_47µF_10V_X7R_10%) 1210; X7R
- (in symbol RES_0402_2.2R_1%) 0402
- (in symbol RES_0402_2k_1%) 0402
- (in symbol RES_0402_4.02k_1%) 0402
- (in symbol RES_0402_10k_1%) 0402
- (in symbol RES_0402_24k_1%) 0402
- (in symbol RES_0402_49.9k_1%) 0402
- (in symbol RES_0402_52.3k_1%) 0402
- (in symbol RES_0402_75k_1%) 0402
- (in symbol RES_0402_100k_1%) 0402
- (in symbol RES_0402_105k_1%) 0402
- (in symbol RES_0402_453k_1%) 0402
- (in symbol RES_0402_562k_1%) 0402
- (in symbol Würth Standoff M2.5 h:10mm) M2.5 threaded; 10mm

### Library data of the parts
C400 C403 C408 C413 C415 C418 C420 C423 = CAP_0402_100nF_50V: as C100 on sheet 01_SERIALIZER_V1-0; Manufacturer 2: TDK
C401 C402 = CAP_1210_10µF_50V_X7R_10%: Multilayer Ceramic Capacitors MLCC - SMD/SMT 10 uF 50 VDC 10% 1210 X7R; Manufacturer 1: Murata Electronics; Manufacturer 1 Prt. Nr.: GRJ32ER71H106KE11L; Manufacturer 2 Prt. Nr.: C1210C106K5RACTU; Manufacturer 2: KEMET
C404 = CAP_0402_22nF_50V: as C119 on sheet 01_SERIALIZER_V1-0; Manufacturer 2: Walsin
C405 C412 = CAP_0402_4.7nF_50V_X7R_10%: Multilayer Ceramic Capacitors MLCC - SMD/SMT 50V 0.022uF X7R 0402 10%; Manufacturer 1: Murata Electronics; Manufacturer 1 Prt. Nr.: GCM155R71H472KA37J; Manufacturer 2 Prt. Nr.: C0402C472K5RAC7411; Manufacturer 2: KEMET
C406 C407 = CAP_1210_47µF_10V_X7R_10%: Multilayer Ceramic Capacitors MLCC - SMD/SMT 47 uF 10 VDC 10% 1210 X7R; Manufacturer 1: Murata Electronics; Manufacturer 1 Prt. Nr.: GRM32ER71A476KE15L; Manufacturer 2 Prt. Nr.: C1210C106K8RACTU; Manufacturer 2: KEMET
C409 = CAP_0402_1µF_16V: as C101 on sheet 01_SERIALIZER_V1-0; Manufacturer 2: Murata Electronics
C410 C414 = CAP_0603_4.7µF_10V_X7R_10%: Multilayer Ceramic Capacitors MLCC - SMD/SMT 4.7 uF 10 VDC 10% 0603 X7R; Manufacturer 1: Murata Electronics; Manufacturer 1 Prt. Nr.: GRM188Z71A475KE15D; Manufacturer 2 Prt. Nr.: 0603B475K100NT; Manufacturer 2: FH (Guangdong Fenghua Advanced Tech)
C411 = CAP_0402_33nF_50V: as C106 on sheet 01_SERIALIZER_V1-0; Manufacturer 2: Yageo
C416 C417 = CAP_0603_10µF_6.3V: Multilayer Ceramic Capacitors MLCC - SMD/SMT 0603 6.3VDC; Manufacturer 1: Murata Electronics; Manufacturer 1 Prt. Nr.: GRM188R60J106ME84J; Manufacturer 2 Prt. Nr.: JMK107ABJ106MA-T; Manufacturer 2: Taiyo Yuden
C419 C421 = CAP_0603_1µF_16V_X7R_10%: as C304 on sheet 03_CONNECTORS_V1-0; Manufacturer 2: KEMET
C422 = CAP_0805_10µF_16V_X7R_10%: Multilayer Ceramic Capacitors MLCC - SMD/SMT 16V 10uF X7R 0805 10%; Manufacturer 1: KYOCERA AVX; Manufacturer 1 Prt. Nr.: 0805YC106KAT2A; Manufacturer 2 Prt. Nr.: CL21B106KOQNNNG; Manufacturer 2: Samsung Electro-Mechanics
H400-H403 = Würth Standoff M2.5 h:10mm: Würth Standoff M2.5 h:10mm 9774050151R; Manufacturer 1: Würth Elektronik; Manufacturer 1 Prt. Nr.: 9774100151R
L400 = 7447714220_22uH_20%_3.0A_50mΩ_SMD: Power Inductors - SMD WE-PD 22uH 3A DCR=50mOhms; Manufacturer 1: Wurth Elektronik; Manufacturer 1 Prt. Nr.: 7447714220; ClassName: ComponentsOverlap
L401 = IHLP4040DZER150M11_15uH_20%_6.0A_45mΩ_SMD: 15uH ±20% 6A 45mΩ SMD,10.16x10.16x4mm Power Inductor; Manufacturer 1: Visay Dale; Manufacturer 1 Prt. Nr.: IHLP4040DZER150M11; ClassName: ComponentsOverlap
L402 = 742792031 _Ferrite_Beads_0805_300Ohms_3000mA: as L304 on sheet 03_CONNECTORS_V1-0; Manufacturer 1 Prt. Nr.: 742792031
L403 = 74479299210_Fixed_Inductors_1.0uH_30%_3A_SMD1210: Fixed Power Inductor - SMD WE-PMCI 1210 1.0uH 3A 38mOhms 30%Tol; Manufacturer 1: Wurth Elektronik; Manufacturer 1 Prt. Nr.: 74479299210
L404 = 742792641_Ferrite_Beads_0603_300Ohms_1500mA: Ferrite Beads WE-CBF 0603 100MHz 300Ohm 2000mA AEC-Q200; Manufacturer 1: Wurth Elektronik; Manufacturer 1 Prt. Nr.: 742792641
R400 = RES_0402_2.2R_1%: Thick Film Resistors - SMD 2.2Ohm 1%; Manufacturer 1: Vishay / Dale; Manufacturer 1 Prt. Nr.: CRCW04022R20JNED; Manufacturer 2 Prt. Nr.: RC0402FR-7W2R2L; Manufacturer 2: Yageo
R401 = RES_0402_562k_1%: Thick Film Resistors - SMD 562kOhms 62.5mW 0402 1%; Manufacturer 1: Vishay / Dale; Manufacturer 1 Prt. Nr.: CRCW0402562KFKEDC; Manufacturer 2 Prt. Nr.: AC0402FR-07562KL; Manufacturer 2: Yageo
R402 R412 = RES_0402_100k_1%: Thick Film Resistors - SMD 100kOhm 1%; Manufacturer 1: Vishay / Dale; Manufacturer 1 Prt. Nr.: CRCW0402100KFKEDC; Manufacturer 2 Prt. Nr.: RC0402FR-7W100KL; Manufacturer 2: Yageo
R403 = RES_0402_4.02k_1%: as R300 on sheet 03_CONNECTORS_V1-0; Manufacturer 2: Yageo
R404 = RES_0402_49.9k_1%: Thick Film Resistors - SMD 49.9kOhm 1%; Manufacturer 1: Vishay / Dale; Manufacturer 1 Prt. Nr.: CRCW040249K9FKEDC; Manufacturer 2 Prt. Nr.: RC0402FR-7W49K9L; Manufacturer 2: Yageo
R405 = RES_0402_52.3k_1%: Thick Film Resistors - SMD 52.3kOhm 1%; Manufacturer 1: Vishay / Dale; Manufacturer 1 Prt. Nr.: CRCW040252K3FKEDC; Manufacturer 2 Prt. Nr.: RC0402FR-1352K3L; Manufacturer 2: Yageo
R406 = RES_0402_75k_1%: Thick Film Resistors - SMD 75kOhm 1%; Manufacturer 1: Vishay / Dale; Manufacturer 1 Prt. Nr.: CRCW040275K0FKEDC; Manufacturer 2 Prt. Nr.: AC0402FR-0775KL; Manufacturer 2: Yageo
R407 = RES_0402_2k_1%: Thick Film Resistors - SMD 2 kOhms 62.5mW 0402 1%; Manufacturer 1: Vishay / Dale; Manufacturer 1 Prt. Nr.: CRCW04022K00FKEDC; Manufacturer 2 Prt. Nr.: RC0402FR-072KL; Manufacturer 2: Yageo
R408 = RES_0402_24k_1%: Thick Film Resistors - SMD 24kOhm 1%; Manufacturer 1: Vishay / Dale; Manufacturer 1 Prt. Nr.: CRCW040224K0FKEDC; Manufacturer 2 Prt. Nr.: RC0402FR-7W24KL; Manufacturer 2: Yageo
R409 = RES_0402_105k_1%: Thick Film Resistors - SMD 105kOhm 1%; Manufacturer 1: Vishay / Dale; Manufacturer 1 Prt. Nr.: CRCW0402105KFKEDC; Manufacturer 2 Prt. Nr.: RC0402FR-13105KL; Manufacturer 2: Yageo
R410 R413 = RES_0402_10k_1%: as R106 on sheet 01_SERIALIZER_V1-0; Manufacturer 2: Yageo
R411 = RES_0402_453k_1%: Thick Film Resistors - SMD 1/16watt 453Kohms 1%; Manufacturer 1: Vishay / Dale; Manufacturer 1 Prt. Nr.: CRCW0402453KFKED; Manufacturer 2 Prt. Nr.: CR0402-FX-4533GLF; Manufacturer 2: Bourns
U400 = SIC463ED-T1-GE3_Switching_Voltage_Regulator_4A: Switching Voltage Regulators 4A, 4.5-60V buck reg 100kHZ to 2MHz; 5 mm x 5 mm MLP55-27L package; Manufacturer 1: Vishay Siliconix; Manufacturer 1 Prt. Nr.: SIC463ED-T1-GE3
U401 = TLV62568ADRL_Step Down Converter 1A; 2A: Step Down Converter with Forced PWM in SOT563 Package; Manufacturer 1: Texas Instruments; Manufacturer 1 Prt. Nr.: TLV62568ADRL
U402 = LP5907MFX-1.8/NOPB_LDO_Voltage_Regulators_250mA: LDO Spannungs-Regulator 250mA Ultra-Lo Noise LDO Reg SOT23-5; Manufacturer 1: Texas Instruments; Manufacturer 1 Prt. Nr.: LP5907MFX-1.8/NOPB

## Sheet 02_I2C_V1-0.SchDoc: RPi GS CAM SER.
size A3; Date: 2023-05-29; Author: M. Weimann; Organization: Altium Limited; Revision: 1.0; SheetNumber: 3; SheetTotal: 5; Title_Subtitle: I2C; Language: DE; Department: F&E; Filename: RPi-GS-CAM-SER_PCB_V1-0.PDF; Project: PI-0017; DocType: Stromlauf; ItemNo-PCB: n/a
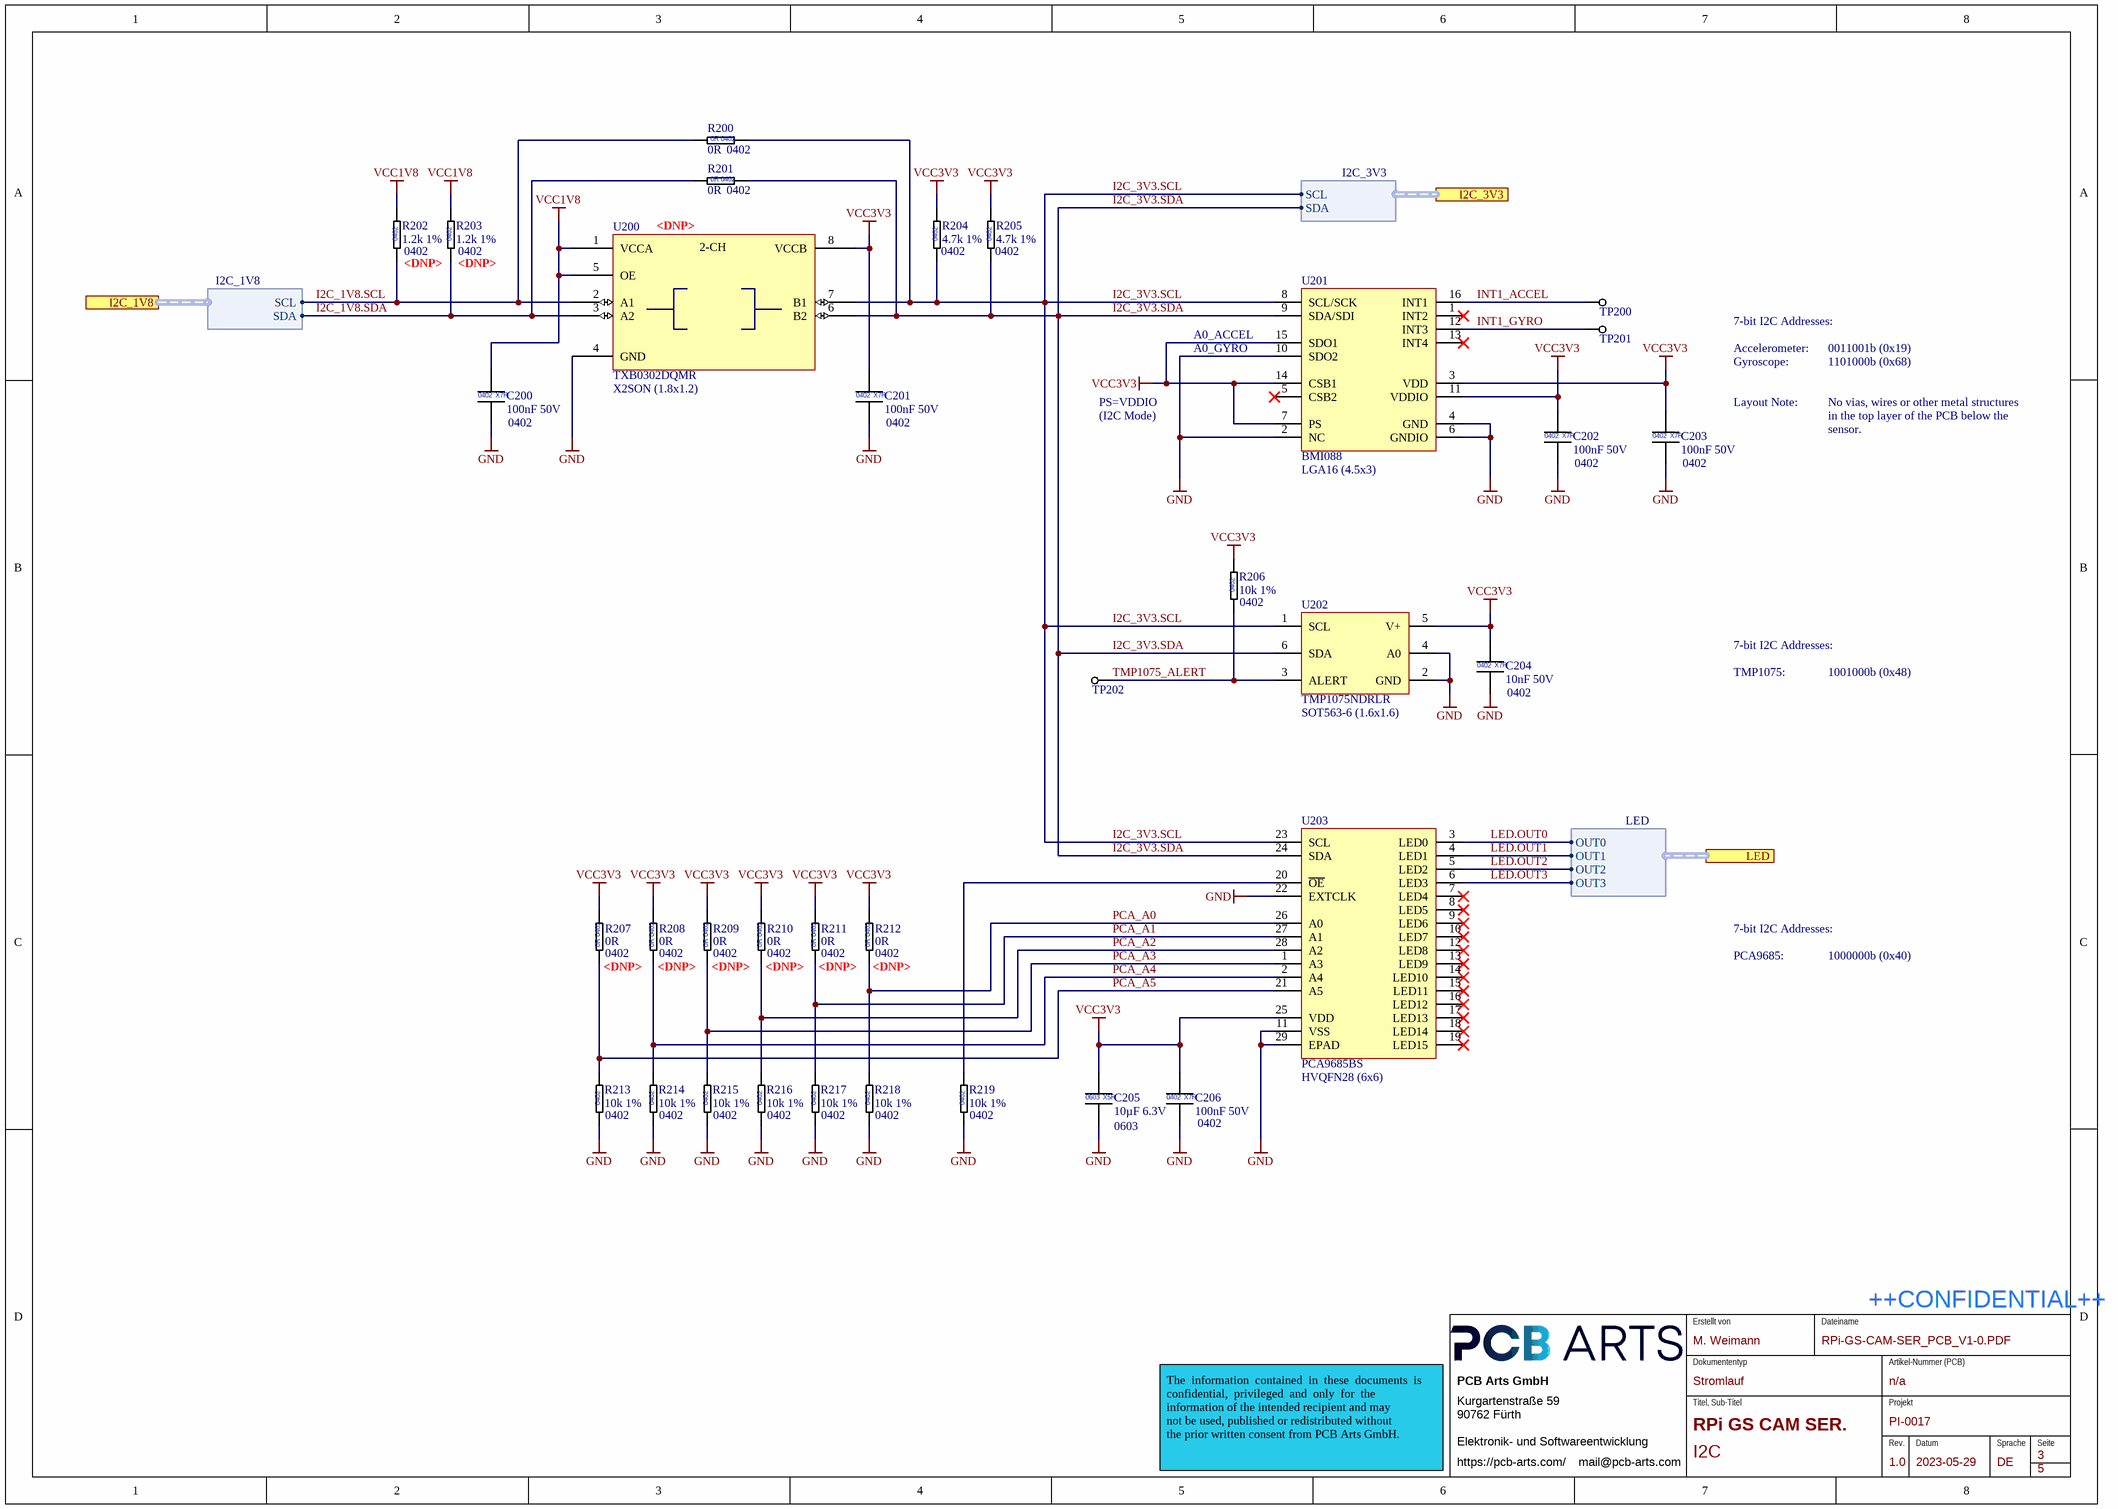
[diagram p5: 02_I2C_V1-0.SchDoc]

### Parts
C200  100nF 50V  [CAP_0402_L]
C201  100nF 50V  [CAP_0402_L]
C202  100nF 50V  [CAP_0402_L]
C203  100nF 50V  [CAP_0402_L]
C204  10nF 50V  [CAP_0402_L]
C205  10µF 6.3V  [CAP_0603_L]
C206  100nF 50V  [CAP_0402_L]
R200  0R Jumper  [RES_0402_L]  (value not drawn)
R201  0R Jumper  [RES_0402_L]  (value not drawn)
R202  1.2k 1%  [RES_0402_L]  (no BOM)
R203  1.2k 1%  [RES_0402_L]  (no BOM)
R204  4.7k 1%  [RES_0402_L]
R205  4.7k 1%  [RES_0402_L]
R206  10k 1%  [RES_0402_L]
R207  0R Jumper  [RES_0402_L]  (value not drawn)  (no BOM)
R208  0R Jumper  [RES_0402_L]  (value not drawn)  (no BOM)
R209  0R Jumper  [RES_0402_L]  (value not drawn)  (no BOM)
R210  0R Jumper  [RES_0402_L]  (value not drawn)
R211  0R Jumper  [RES_0402_L]  (value not drawn)  (no BOM)
R212  0R Jumper  [RES_0402_L]  (value not drawn)  (no BOM)
R213  10k 1%  [RES_0402_L]
R214  10k 1%  [RES_0402_L]
R215  10k 1%  [RES_0402_L]
R216  10k 1%  [RES_0402_L]
R217  10k 1%  [RES_0402_L]
R218  10k 1%  [RES_0402_L]
R219  10k 1%  [RES_0402_L]
TP200  Testpoint  [Testpoint 0.8mm]  (value not drawn)  (no BOM)
TP201  Testpoint  [Testpoint 0.8mm]  (value not drawn)  (no BOM)
TP202  Testpoint  [Testpoint 0.8mm]  (value not drawn)  (no BOM)
U200  TXB0302DQMR  [SON40P120X40-8N]  (no BOM)
U201  BMI088  [LGA50P450X300X100-16N]
U202  TMP1075NDRLR  [SOT50P160X60-6N_SOT563]
U203  PCA9685BS  [QFN65P600X600X100_HS-29N]

### Ports
I2C_1V8 (harness I2C_1V8, see 00_RPi-GS-CAM-SER_V1-0[4B], 01_SERIALIZER_V1-0[7A]), I2C_3V3 (harness I2C_3V3, see 00_RPi-GS-CAM-SER_V1-0[5B], 03_CONNECTORS_V1-0[1B]), LED (harness LED, see 00_RPi-GS-CAM-SER_V1-0[5B], 03_CONNECTORS_V1-0[1C])

### Harnesses
LED: OUT0, OUT1, OUT2, OUT3
I2C_1V8: SCL, SDA
I2C_3V3: SCL, SDA

### Nets
GND: C200.2 C201.2 C202.2 C203.2 C204.2 C205.2 C206.2 R213.1 R214.1 R215.1 R216.1 R217.1 R218.1 R219.1 U200.4(GND) U201.2(NC) U201.4(GND) U201.6(GNDIO) U201.10(SDO2) U202.2(GND) U202.4(A0) U203.11(VSS) U203.22(EXTCLK) U203.29(EPAD)
VCC1V8: C200.1 R202.2 R203.2 U200.1(VCCA) U200.5(OE)
VCC3V3: C201.1 C202.1 C203.1 C204.1 C205.1 C206.1 R204.2 R205.2 R206.2 R207.2 R208.2 R209.2 R210.2 R211.2 R212.2 U200.8(VCCB) U201.3(VDD) U201.7(PS) U201.11(VDDIO) U201.14(CSB1) U201.15(SDO1) U202.5(V+) U203.25(VDD)
I2C_1V8.SCL: R200.1 R202.1 U200.2(A1) ; port I2C_1V8.SCL
I2C_1V8.SDA: R201.1 R203.1 U200.3(A2) ; port I2C_1V8.SDA
I2C_3V3.SCL: R200.2 R204.1 U200.7(B1) U201.8(SCL/SCK) U202.1(SCL) U203.23(SCL) ; port I2C_3V3.SCL
I2C_3V3.SDA: R201.2 R205.1 U200.6(B2) U201.9(SDA/SDI) U202.6(SDA) U203.24(SDA) ; port I2C_3V3.SDA
INT1_ACCEL: TP200.1(GND) U201.16(INT1)
INT1_GYRO: TP201.1(GND) U201.12(INT3)
LED.OUT0: U203.3(LED0) ; port LED.OUT0
LED.OUT1: U203.4(LED1) ; port LED.OUT1
LED.OUT2: U203.5(LED2) ; port LED.OUT2
LED.OUT3: U203.6(LED3) ; port LED.OUT3
PCA_A0: R212.1 R218.2 U203.26(A0)
PCA_A1: R211.1 R217.2 U203.27(A1)
PCA_A2: R210.1 R216.2 U203.28(A2)
PCA_A3: R209.1 R215.2 U203.1(A3)
PCA_A4: R208.1 R214.2 U203.2(A4)
PCA_A5: R207.1 R213.2 U203.21(A5)
TMP1075_ALERT: R206.1 TP202.1(GND) U202.3(ALERT)
NetR219_2: R219.2 U203.20(~{OE})

Not connected (* = marked no-connect by the designer): U201 1(INT2)* 5(CSB2)* 13(INT4)*; U203 7(LED4)* 8(LED5)* 9(LED6)* 10(LED7)* 12(LED8)* 13(LED9)* 14(LED10)* 15(LED11)* 16(LED12)* 17(LED13)* 18(LED14)* 19(LED15)*

### Notes on the sheet
- (near R200) 0R
- (near R200) 0402
- (near U200) <DNP>
- (near R201) 0R
- (near R201) 0402
- (near R202) 0402
- <DNP>
- (near R203) 0402
- (near R203) <DNP>
- (near R204) 0402
- (near R205) 0402
- A0_GYRO
- A0_ACCEL
- Accelerometer:
- 7-bit I2C Addresses:
- Gyroscope:
- 0011001b (0x19)
- 1101000b (0x68)
- (near C200) 0402
- (near U200) X2SON (1.8x1.2)
- (near C201) 0402
- PS=VDDIO
- (I2C Mode)
- Layout Note:
- No vias, wires or other metal structures
- in the top layer of the PCB below the
- sensor.
- (near U201) LGA16 (4.5x3)
- (near C202) 0402
- (near C203) 0402
- (near R206) 0402
- (near U202) SOT563-6 (1.6x1.6)
- (near C204) 0402
- TMP1075:
- 1001000b (0x48)
- (near R207) <DNP>
- (near R207) 0402
- (near R207) 0R
- (near R208) <DNP>
- (near R208) 0402
- (near R208) 0R
- (near R209) <DNP>
- (near R209) 0402
- (near R209) 0R
- (near R210) <DNP>
- (near R210) 0402
- (near R210) 0R
- (near R211) <DNP>
- (near R211) 0402
- (near R211) 0R
- (near R212) <DNP>
- (near R212) 0402
- (near R212) 0R
- PCA9685:
- 1000000b (0x40)
- (near R213) 0402
- (near R214) 0402
- (near R215) 0402
- (near R216) 0402
- (near R217) 0402
- (near R218) 0402
- (near R219) 0402
- (near C206) 0402
- (near U203) HVQFN28 (6x6)
- (near C205) 0603
- Erstellt von
- Dateiname
- ++CONFIDENTIAL++
- PCB Arts GmbH
- Dokumententyp
- Artikel-Nummer (PCB)
- Kurgartenstraße 59
- 90762 Fürth
- Elektronik- und Softwareentwicklung
- Titel, Sub-Titel
- Projekt
- Rev.
- Datum
- Sprache
- Seite
- The  information  contained  in  these  documents  is  confidential,  privileged  and  only  for  the
  information of the intended recipient and may
  not be used, published or redistributed without
  the prior written consent from PCB Arts GmbH.
- https://pcb-arts.com/
- mail@pcb-arts.com
- (in symbol CAP_0402_10nF_50V) 0402; X7R
- (in symbol CAP_0402_100nF_50V) 0402; X7R
- (in symbol CAP_0603_10µF_6.3V) 0603; X5R
- (in symbol RES_0402_0R Jumper) 0R 0402
- (in symbol RES_0402_1.2k_1%) 0402
- (in symbol RES_0402_4.7k_1%) 0402
- (in symbol RES_0402_10k_1%) 0402
- (in symbol TXB0302DQMR_Translation - Voltage Levels 2B Bidir Vltg-Level Translator) 2-CH

### Library data of the parts
C200-C203 C206 = CAP_0402_100nF_50V: as C100 on sheet 01_SERIALIZER_V1-0; Manufacturer 2: TDK
C204 = CAP_0402_10nF_50V: as C102 on sheet 01_SERIALIZER_V1-0; Manufacturer 2: Yageo
C205 = CAP_0603_10µF_6.3V: as C416 on sheet 04_POWER_V1-0; Manufacturer 2: Taiyo Yuden
R200 R201 R207-R212 = RES_0402_0R Jumper: as R101 on sheet 01_SERIALIZER_V1-0; Manufacturer 2: Yageo
R202 R203 = RES_0402_1.2k_1%: as R105 on sheet 01_SERIALIZER_V1-0; Manufacturer 2: Yageo
R204 R205 = RES_0402_4.7k_1%: Thick Film Resistors - SMD 4.7kOhm 1%; Manufacturer 1: Vishay / Dale; Manufacturer 1 Prt. Nr.: CRCW04024K70FKEDC; Manufacturer 2 Prt. Nr.: RC0402FR-134K7L; Manufacturer 2: Yageo
R206 R213-R219 = RES_0402_10k_1%: as R106 on sheet 01_SERIALIZER_V1-0; Manufacturer 2: Yageo
TP200-TP202 = Testpoint 0.8mm
U200 = TXB0302DQMR_Translation - Voltage Levels 2B Bidir Vltg-Level Translator: Translation - Voltage Levels 2B Bidir Vltg-Level Translator; Manufacturer 1: Texas Instruments; Manufacturer 1 Prt. Nr.: TXB0302DQMR
U201 = BMI088_High_Performance_Intertial_Measurement_Unit_(IMU): IMUs - High Performance Intertial Measurement Unit (IMU) for Drones and Robotics LGA16 4,5 mm x 3,0 mm; Manufacturer 1: Bosch Sensortec; Manufacturer 1 Prt. Nr.: BMI088
U202 = TMP1075NDRLR_Board_Mount_I2C_Temperature_Sensor: Board Mount I2C Temperature Sensors with performance upgrades to industry standard LM75 / TMP75  SOT563 1,6 mm x 1,6 mm; Manufacturer 1: Texas Instruments; Manufacturer 1 Prt. Nr.: TMP1075NDRLR
U203 = PCA9685BS_16-CH_12-BIT-PWM_I2C_LED-CTRL: LED-Anzeigetreiber 16-CH 12-BIT PWM FM+ I2C-BUS LED CTRL HVQFN28 6 mm x 6 mm; Manufacturer 1: NXP; Manufacturer 1 Prt. Nr.: PCA9685BS, 118

## Nets that join several sheets
GND: 01_SERIALIZER_V1-0 (32 pins), 03_CONNECTORS_V1-0 (30 pins), 04_POWER_V1-0 (41 pins), 02_I2C_V1-0 (24 pins)
VCC1V8: 01_SERIALIZER_V1-0 (8 pins), 04_POWER_V1-0 (C421.1 C422.1 U402.5), 02_I2C_V1-0 (5 pins)
VCC3V3: 03_CONNECTORS_V1-0 (8 pins), 04_POWER_V1-0 (7 pins), 02_I2C_V1-0 (23 pins)
VCC5V: 03_CONNECTORS_V1-0 (C306.1 L304.1), 04_POWER_V1-0 (7 pins)
VCC24V: 01_SERIALIZER_V1-0 (R103.2), 03_CONNECTORS_V1-0 (C300.1 C301.1 L302.2 R300.2), 04_POWER_V1-0 (9 pins)
CAM.CLK: 01_SERIALIZER_V1-0 (R101.2), 03_CONNECTORS_V1-0 (U300.1)
CAM.GPO: 01_SERIALIZER_V1-0 (U100.27), 03_CONNECTORS_V1-0 (U301.1)
CSI.CLK_N: 01_SERIALIZER_V1-0 (U100.6), 03_CONNECTORS_V1-0 (D300.6 J301.8)
CSI.CLK_P: 01_SERIALIZER_V1-0 (U100.5), 03_CONNECTORS_V1-0 (D300.5 J301.9)
CSI.D0_N: 01_SERIALIZER_V1-0 (U100.4), 03_CONNECTORS_V1-0 (D300.1 J301.2)
CSI.D0_P: 01_SERIALIZER_V1-0 (U100.3), 03_CONNECTORS_V1-0 (D300.9 J301.3)
CSI.D1_N: 01_SERIALIZER_V1-0 (U100.2), 03_CONNECTORS_V1-0 (D300.2 J301.5)
CSI.D1_P: 01_SERIALIZER_V1-0 (U100.1), 03_CONNECTORS_V1-0 (D300.8 J301.6)
FPD_OUT: 01_SERIALIZER_V1-0 (C106.2), 03_CONNECTORS_V1-0 (J300.1 L300.1)
I2C_1V8.SCL: 01_SERIALIZER_V1-0 (U100.24), 02_I2C_V1-0 (R200.1 R202.1 U200.2)
I2C_1V8.SDA: 01_SERIALIZER_V1-0 (U100.23), 02_I2C_V1-0 (R201.1 R203.1 U200.3)
I2C_3V3.SCL: 03_CONNECTORS_V1-0 (D301.8 J301.13 J302.6 J303.5), 02_I2C_V1-0 (6 pins)
I2C_3V3.SDA: 03_CONNECTORS_V1-0 (D301.9 J301.14 J302.5 J303.6), 02_I2C_V1-0 (6 pins)
LED.OUT0: 03_CONNECTORS_V1-0 (D303.6 J302.8 J303.7), 02_I2C_V1-0 (U203.3)
LED.OUT1: 03_CONNECTORS_V1-0 (D303.4 J302.7 J303.8), 02_I2C_V1-0 (U203.4)
LED.OUT2: 03_CONNECTORS_V1-0 (D303.1 J302.10 J303.9), 02_I2C_V1-0 (U203.5)
LED.OUT3: 03_CONNECTORS_V1-0 (D303.3 J302.9 J303.10), 02_I2C_V1-0 (U203.6)